# EasyEDA Pro project v3_uecu_hibrid.epro

# Schematic UECU
Board Name: UECU; Create Date: 2025-11-15; Page Name: UECU; Project Name: ECU_v3; Schematic Name: UECU; Update Date: 2025-12-18; File: UECU; Id: /; Sheet: /
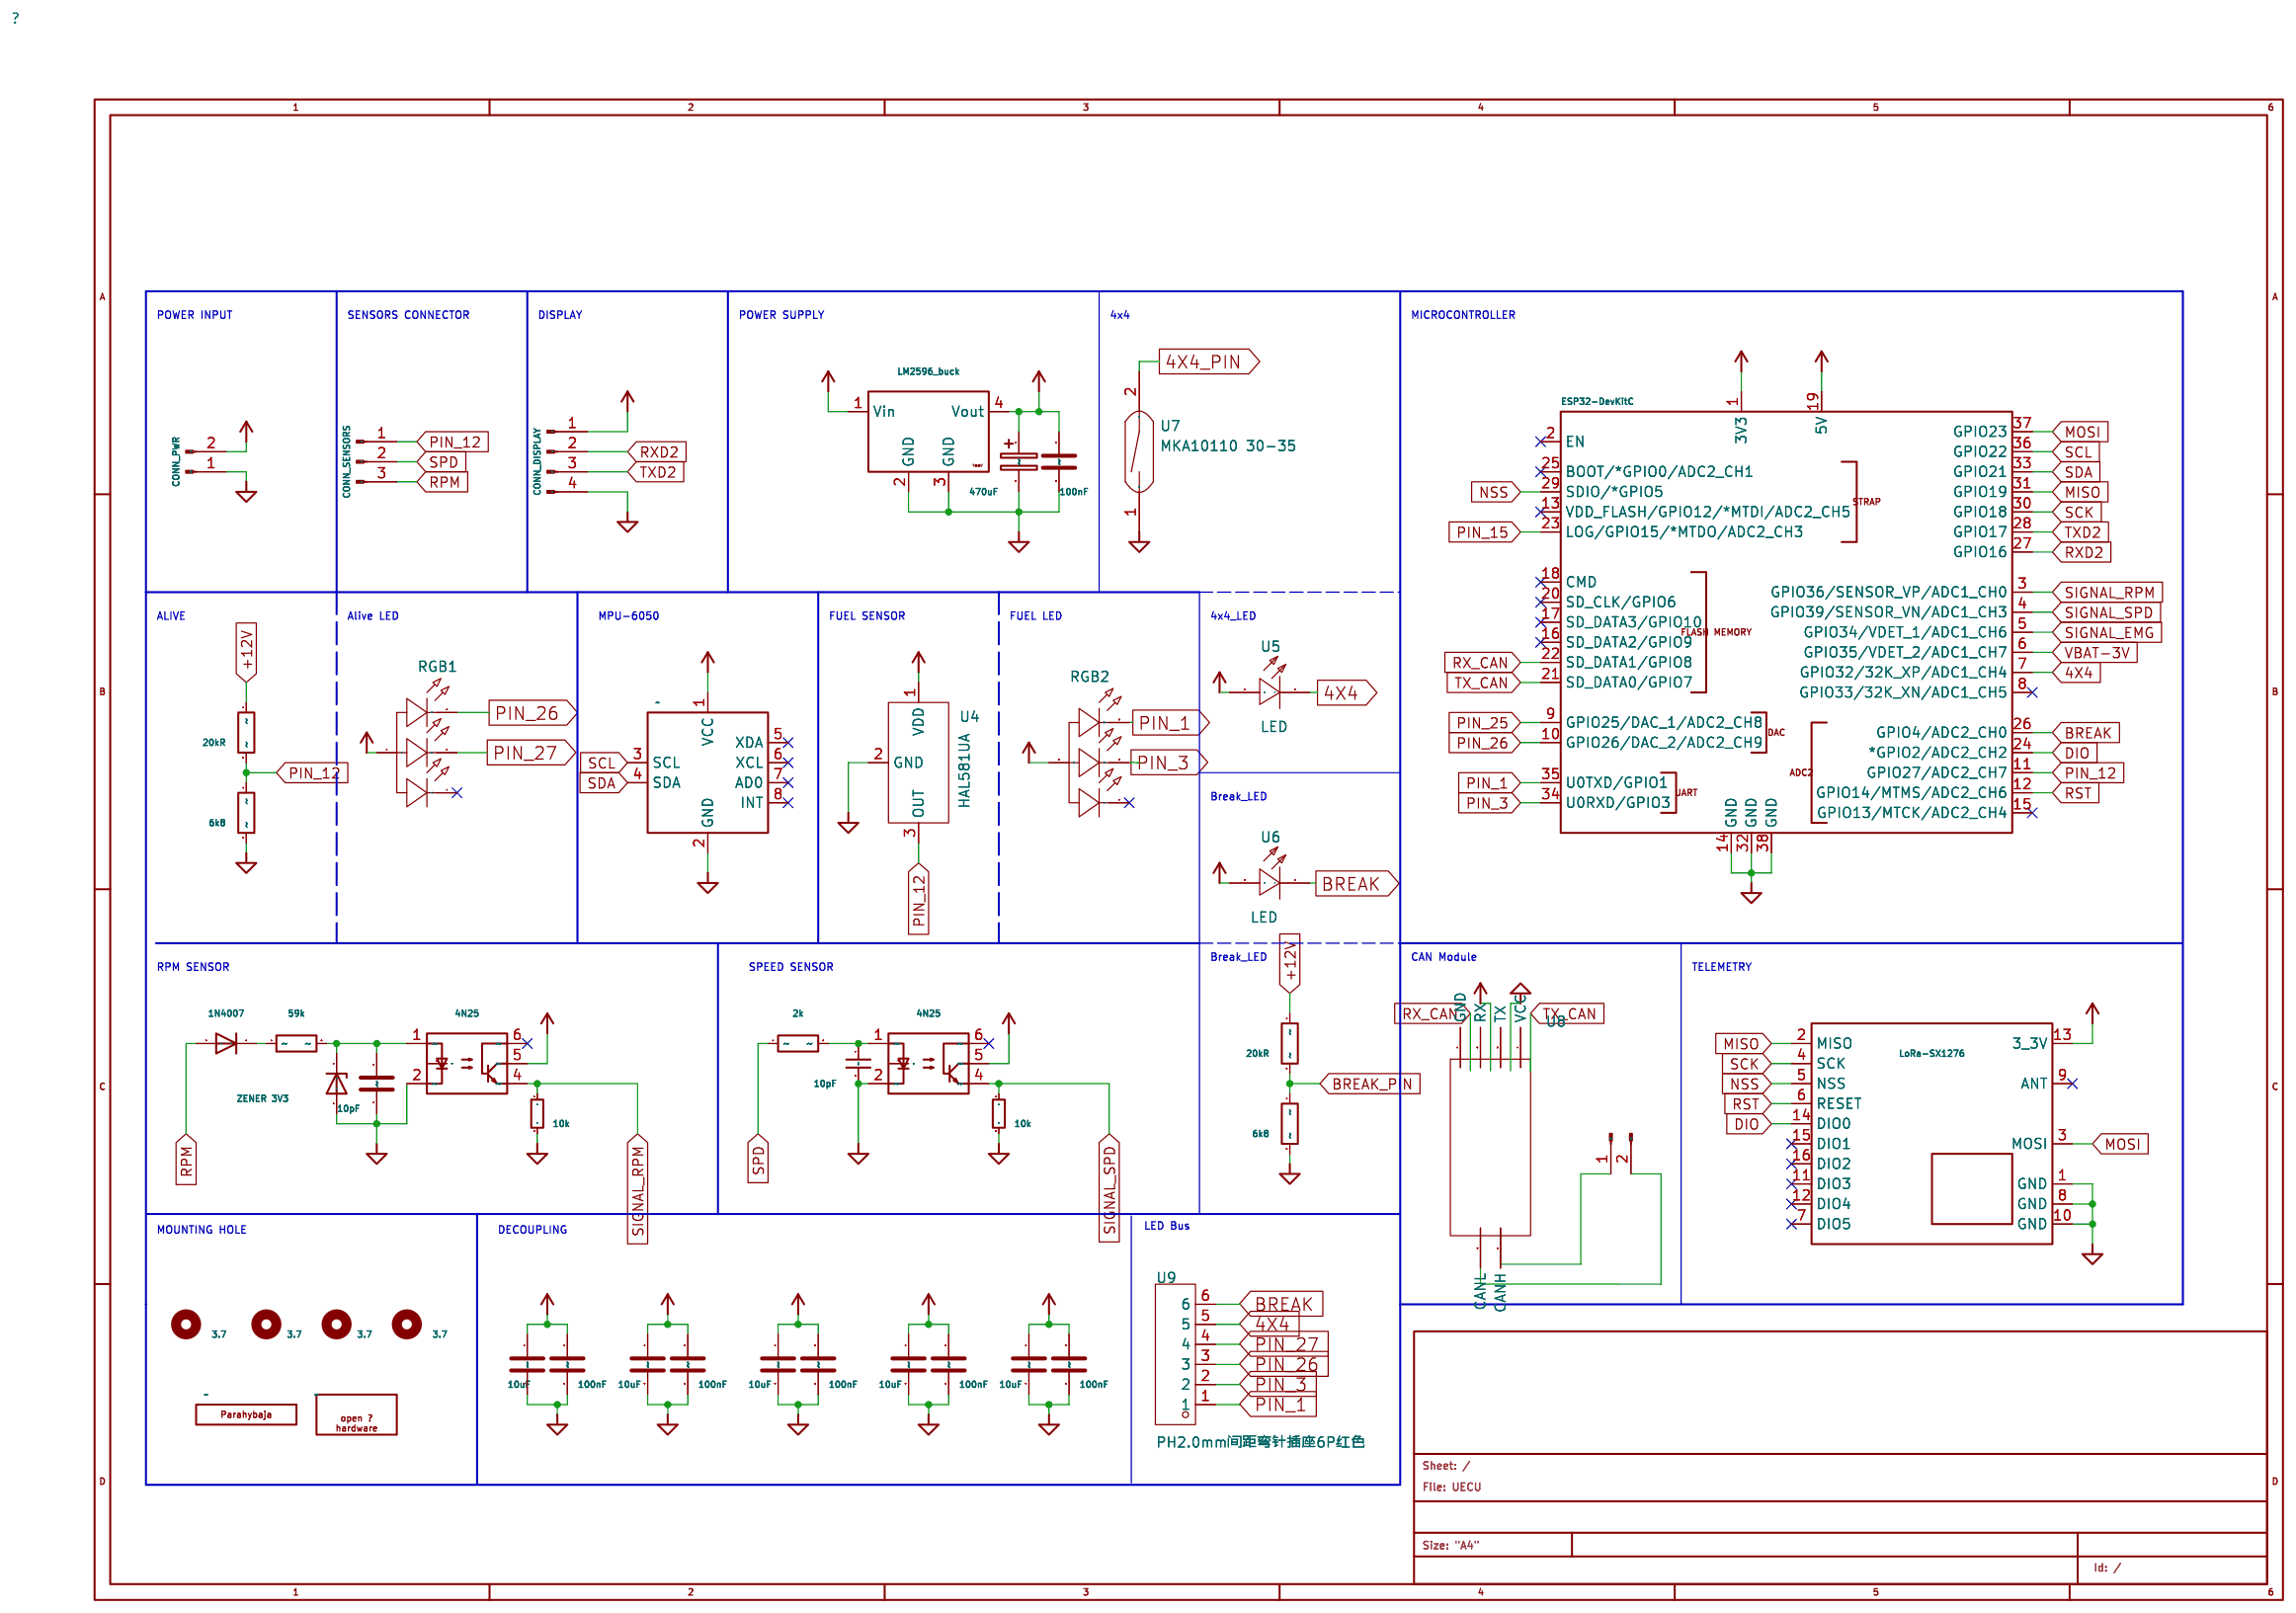
[diagram p0: schematic sheet]

## Parts
C1  470uF  [Capacitor_THT:CP_Radial_D6.3mm_P2.50mm]
C2  100nF  [Capacitor_THT:C_Disc_D5.0mm_W2.5mm_P5.00mm]
C4  100nF  [Capacitor_THT:C_Disc_D5.0mm_W2.5mm_P5.00mm]
C5  10uF  [Capacitor_THT:C_Disc_D5.0mm_W2.5mm_P5.00mm]
C6  100nF  [Capacitor_THT:C_Disc_D5.0mm_W2.5mm_P5.00mm]
C7  10uF  [Capacitor_THT:C_Disc_D5.0mm_W2.5mm_P5.00mm]
C8  10pF  [Capacitor_THT:C_Disc_D5.0mm_W2.5mm_P5.00mm]
C9  10uF  [Capacitor_THT:C_Disc_D5.0mm_W2.5mm_P5.00mm]
C10  100nF  [Capacitor_THT:C_Disc_D5.0mm_W2.5mm_P5.00mm]
C11  100nF  [Capacitor_THT:C_Disc_D5.0mm_W2.5mm_P5.00mm]
C12  10uF  [Capacitor_THT:C_Disc_D5.0mm_W2.5mm_P5.00mm]
C13  10uF  [Capacitor_THT:C_Disc_D5.0mm_W2.5mm_P5.00mm]
C14  10pF  [Capacitor_THT:C_Disc_D5.0mm_W2.5mm_P5.00mm]
C15  100nF  [Capacitor_THT:C_Disc_D5.0mm_W2.5mm_P5.00mm]
D2  1N4007  [Diode_THT:D_A-405_P7.62mm_Horizontal]
D3  ZENER 3V3  [Diode_THT:D_A-405_P7.62mm_Horizontal]
H1  3.7  [MountingHole:MountingHole_3.7mm]
H2  3.7  [MountingHole:MountingHole_3.7mm]
H3  3.7  [MountingHole:MountingHole_3.7mm]
H4  3.7  [MountingHole:MountingHole_3.7mm]
J1  CONN_PWR  [Connector_JST:JST_XH_B2B-XH-A_1x02_P2.50mm_Vertical]
J2  CONN_SENSORS  [Connector_JST:JST_XH_B3B-XH-A_1x03_P2.50mm_Vertical]
J3  CONN_DISPLAY  [Connector_JST:JST_XH_B4B-XH-A_1x04_P2.50mm_Vertical]
J5  CONN_CAN_BUS  [Connector_JST:JST_XH_B2B-XH-A_1x02_P2.50mm_Vertical]
L1  -  [Logos:parahybaja]
L2  -  [Logos:open_hardware]
MCU1  ESP32-DevKitC  [Espressif:ESP32-DevKitC]
P1  LM2596_buck  [StepDown:StepDown_LM2596]
R3  20kR  [Resistor_THT:R_Axial_DIN0207_L6.3mm_D2.5mm_P7.62mm_Horizontal]
R6  59k  [Resistor_THT:R_Axial_DIN0207_L6.3mm_D2.5mm_P7.62mm_Horizontal]
R7  2k  [Resistor_THT:R_Axial_DIN0207_L6.3mm_D2.5mm_P7.62mm_Horizontal]
R8  10k  [Resistor_THT:R_Axial_DIN0207_L6.3mm_D2.5mm_P7.62mm_Horizontal]
R9  10k  [Resistor_THT:R_Axial_DIN0207_L6.3mm_D2.5mm_P7.62mm_Horizontal]
R10  6k8  [Resistor_THT:R_Axial_DIN0207_L6.3mm_D2.5mm_P7.62mm_Horizontal]
R11  20kR  [Resistor_THT:R_Axial_DIN0207_L6.3mm_D2.5mm_P7.62mm_Horizontal]
R12  6k8  [Resistor_THT:R_Axial_DIN0207_L6.3mm_D2.5mm_P7.62mm_Horizontal]
RGB1  LED_RGB红蓝双色  [LED-SMD_4P-L3.2-W1.5_LED_RGB-A]
RGB2  LED_RGB红蓝双色  [LED-SMD_4P-L3.2-W1.5_LED_RGB-A]
S1  -  [Connector_PinHeader_2.54mm:PinHeader_1x08_P2.54mm_Vertical]
T1  LoRa-SX1276  [LoRa_SX1276:LoRa_SX1276]
U2  4N25  [Package_DIP:DIP-6_W7.62mm]
U3  4N25  [Package_DIP:DIP-6_W7.62mm]
U4  HAL581UA  [TO-92S-3_L4.1-W1.7-P1.27-L]
U5  LED  [LED-TH_BD4.0-P2.54-FD_RED]
U6  LED  [LED-TH_BD4.0-P2.54-FD_RED]
U7  MKA10110 30-35  [SW-TH_BD1.8-L10.0-P14.00-D0.5]
U8  -  [CAN Module TJA1050]
U9  PH2.0mm间距弯针插座6P红色  [CONN-TH_6P-P2.00_KINGHELM_KH-PH-6P-W]

## Library data of the parts
C1 = Device_C_Polarized
C2 C4-C7 C9-C13 C15 = Device_C: Attribute1: C8
C8 = Device_C
C14 = Device_C_Small
D2 = Device_D: Sim_Device: D; Sim_Pins: 1=K 2=A; Sim.Device: D; Sim.Pins: 1=K 2=A
D3 = Device_D_Zener: Attribute1: K; Attribute3: K
H1 = Mechanical_MountingHole
H2-H4 = Mechanical_MountingHole: Attribute1: H1
J1 = Connector_Conn_01x02_Pin
J2 = Connector_Conn_01x03_Pin: Attribute1: J3
J3 = Connector_Conn_01x04_Pin: Attribute1: J2
J5 = Connector_Conn_01x02_Pin: Attribute1: J1
L1 = Logos_parahybaja
L2 = Logos_open-hardware
MCU1 = Espressif_ESP32-DevKitC: Attribute1: VP/GPIO36; Attribute2: GPIO13/MTCK; Attribute3: GND; Attribute4: GPIO4; Attribute5: GPIO21; Attribute6: GPIO18; Attribute7: 5V; Attribute8: D0; Attribute9: GPIO5; Attribute10: GPIO26; Attribute11: D3; Attribute12: GPIO32; Attribute13: 3V3; Attribute14: VN/GPIO39; Attribute15: GND; Attribute16: GPIO15/MTDO; Attribute17: GND; Attribute18: GPIO27; Attribute19: GPIO22; Attribute20: GPIO25; Attribute21: GPIO23; Attribute22: GPIO33; Attribute23: D2; Attribute24: GPIO17; Attribute25: GPIO3/U0RXD; Attribute26: GPIO12/MTDI; Attribute27: GPIO19; Attribute28: GPIO16; Attribute29: GPIO1/U0TXD; Attribute30: GPIO0; Attribute31: GPIO34; Attribute32: GPIO35; Attribute33: CMD; Attribute34: GPIO2; Attribute35: GPIO14/MTMS; Attribute36: CLK; Attribute37: D1; Attribute38: EN/RESET; Attribute39: REF**; User doc link: https://docs.espressif.com/projects/esp-idf/zh_CN/latest/esp32/hw-reference/esp32/get-started-devkitc.html
P1 = StepDown_LM2596_YAAJ_DCDC_StepDown_LM2596: Attribute1: REF**
R3 R6 R7 R10-R12 = Device_R: Attribute1: R4
R8 R9 = Device_R_Small
RGB1 RGB2 = LED_RGB红蓝双色: Supplier Part: C9900002410; Supplier Footprint: RGB_LED; JLCPCB Part Class: Extended Part; Supplier: LCSC
S1 = MPU6050_MPU6050
T1 = LoRa-SX1276_LoRa-SX1276
U2 = Isolator_4N25: Attribute1: U3; User doc link: https://www.vishay.com/docs/83725/4n25.pdf
U3 = Isolator_4N25: User doc link: https://www.vishay.com/docs/83725/4n25.pdf
U4 = HAL581UA: Type:- Voltage - Supply:3.5V~24V Voltage - Supply:3.5V~24V Output Current:- Operation Points:70Gs Operation Points:70Gs Release Points:45Gs Release Points:45Gs Magnetic delay:25Gs Operating Temperature:-40℃~+150℃ Operating Temperature:-40℃~+150℃; LCSC Part Name: 单极性霍尔开关,马达霍尔管, 停产; Supplier Part: C7420968; Manufacturer: Hallwee(霍尔微电子); Supplier Footprint: TO-92S; JLCPCB Part Class: Extended Part; Datasheet: https://atta.szlcsc.com/upload/public/pdf/source/20230614/912E2566E2C353A023B1CDC2A630033A.pdf; Supplier: LCSC; Voltage - Supply: 3.5V~24V; Operation Points: 70Gs; Release Points: 45Gs; Magnetic delay: 25Gs; Operating Temperature: -40℃~+150℃
U5 U6 = LED: Supplier Part: C9900015665; Supplier Footprint: SIP-2P; JLCPCB Part Class: Extended Part; Supplier: LCSC
U7 = MKA10110 30-35: Supplier Part: C5154119; Manufacturer: MKA; Supplier Footprint: 插件; JLCPCB Part Class: Extended Part; Supplier: LCSC
U8 = CAN Module TJA1050
U9 = PH2.0mm间距弯针插座6P红色: Supplier Part: C9900029679; Supplier Footprint: 6PIN-2.0MM; JLCPCB Part Class: Extended Part; Supplier: LCSC

## Nets
+12V: C7.1 C11.1 J1.2(Pin) P1.1(Vin) R3.1 R11.1
VBAT-3V: MCU1.6(GPIO35/VDET_2/ADC1_CH7)
4X4: MCU1.7(GPIO32/32K_XP/ADC1_CH4) U5.2(-) U9.5
4X4_PIN: U7.2
BREAK: MCU1.26(GPIO4/ADC2_CH0) U6.2(-) U9.6
BREAK_PIN: R11.2 R12.1
DIO: MCU1.24(*GPIO2/ADC2_CH2) T1.14(DIO0)
MISO: MCU1.31(GPIO19) T1.2(MISO)
MOSI: MCU1.37(GPIO23) T1.3(MOSI)
NSS: MCU1.29(SDIO/*GPIO5) T1.5(NSS)
PIN_1: MCU1.35(U0TXD/GPIO1) RGB2.3 U9.1
PIN_3: MCU1.34(U0RXD/GPIO3) RGB2.2 U9.2
PIN_12: J2.1(Pin) MCU1.11(GPIO27/ADC2_CH7) R3.2 R10.1 U4.3(OUT)
PIN_15: MCU1.23(LOG/GPIO15/*MTDO/ADC2_CH3)
PIN_25: MCU1.9(GPIO25/DAC_1/ADC2_CH8)
PIN_26: MCU1.10(GPIO26/DAC_2/ADC2_CH9) RGB1.3 U9.3
PIN_27: RGB1.2 U9.4
POWER_+3V3: C5.1 C6.1 C9.1 C10.1 MCU1.1(3V3) RGB1.1 RGB2.1 T1.13(3_3V) U2.5 U3.5 U4.1(VDD) U5.1(+) U6.1(+)
POWER_+5V: C1.1 C2.1 C4.1 C12.1 C13.1 C15.1 J3.1(Pin) MCU1.19(5V) P1.4(Vout) S1.1(VCC)
POWER_GND: C1.2 C2.2 C4.2 C5.2 C6.2 C7.2 C8.2 C9.2 C10.2 C11.2 C12.2 C13.2 C14.2 C15.2 D3.2(A) J1.1(Pin) J3.4(Pin) MCU1.14(GND) MCU1.32(GND) MCU1.38(GND) P1.2(GND) P1.3(GND) R8.2 R9.2 R10.2 R12.2 S1.2(GND) T1.1(GND) T1.8(GND) T1.10(GND) U2.2 U3.2 U4.2(GND) U7.1
RPM: D2.2(A) J2.3(Pin)
RST: MCU1.12(GPIO14/MTMS/ADC2_CH6) T1.6(RESET)
RX_CAN: MCU1.22(SD_DATA1/GPIO8)
RXD2: J3.2(Pin) MCU1.27(GPIO16)
SCK: MCU1.30(GPIO18) T1.4(SCK)
SCL: MCU1.36(GPIO22) S1.3(SCL)
SDA: MCU1.33(GPIO21) S1.4(SDA)
SIGNAL_EMG: MCU1.5(GPIO34/VDET_1/ADC1_CH6)
SIGNAL_RPM: MCU1.3(GPIO36/SENSOR_VP/ADC1_CH0) R8.1 U2.4
SIGNAL_SPD: MCU1.4(GPIO39/SENSOR_VN/ADC1_CH3) R9.1 U3.4
SPD: J2.2(Pin) R7.1
TX_CAN: MCU1.21(SD_DATA0/GPIO7)
TXD2: J3.3(Pin) MCU1.28(GPIO17)
$1N3: C8.1 D3.1(K) R6.2 U2.1
$1N7: D2.1(K) R6.1
$1N75: C14.1 R7.2 U3.1
$1N8433: J5.1(Pin) U8.6(CANH)
$1N8440: J5.2(Pin) U8.5(CANL)

Not connected (* = marked no-connect by the designer): MCU1 2(EN)* 8(GPIO33/32K_XN/ADC1_CH5)* 13(VDD_FLASH/GPIO12/*MTDI/ADC2_CH5)* 15(GPIO13/MTCK/ADC2_CH4)* 16(SD_DATA2/GPIO9)* 17(SD_DATA3/GPIO10)* 18(CMD)* 20(SD_CLK/GPIO6)* 25(BOOT/*GPIO0/ADC2_CH1)*; RGB1 4*; RGB2 4*; S1 5(XDA)* 6(XCL)* 7(AD0)* 8(INT)*; T1 7(DIO5)* 9(ANT)* 11(DIO3)* 12(DIO4)* 15(DIO1)* 16(DIO2)*; U2 3(NC) 6*; U3 3(NC) 6*; U8 1(GND) 2(RX) 3(TX) 4(VCC)

## Notes on the sheet
- POWER INPUT
- SENSORS CONNECTOR
- DISPLAY
- POWER SUPPLY
- 4x4
- MICROCONTROLLER
- ALIVE
- Alive LED
- MPU-6050
- FUEL SENSOR
- FUEL LED
- 4x4_LED
- Break_LED
- Break_LED
- CAN Module
- RPM SENSOR
- SPEED SENSOR
- TELEMETRY
- MOUNTING HOLE
- DECOUPLING
- LED Bus

# Board UECU
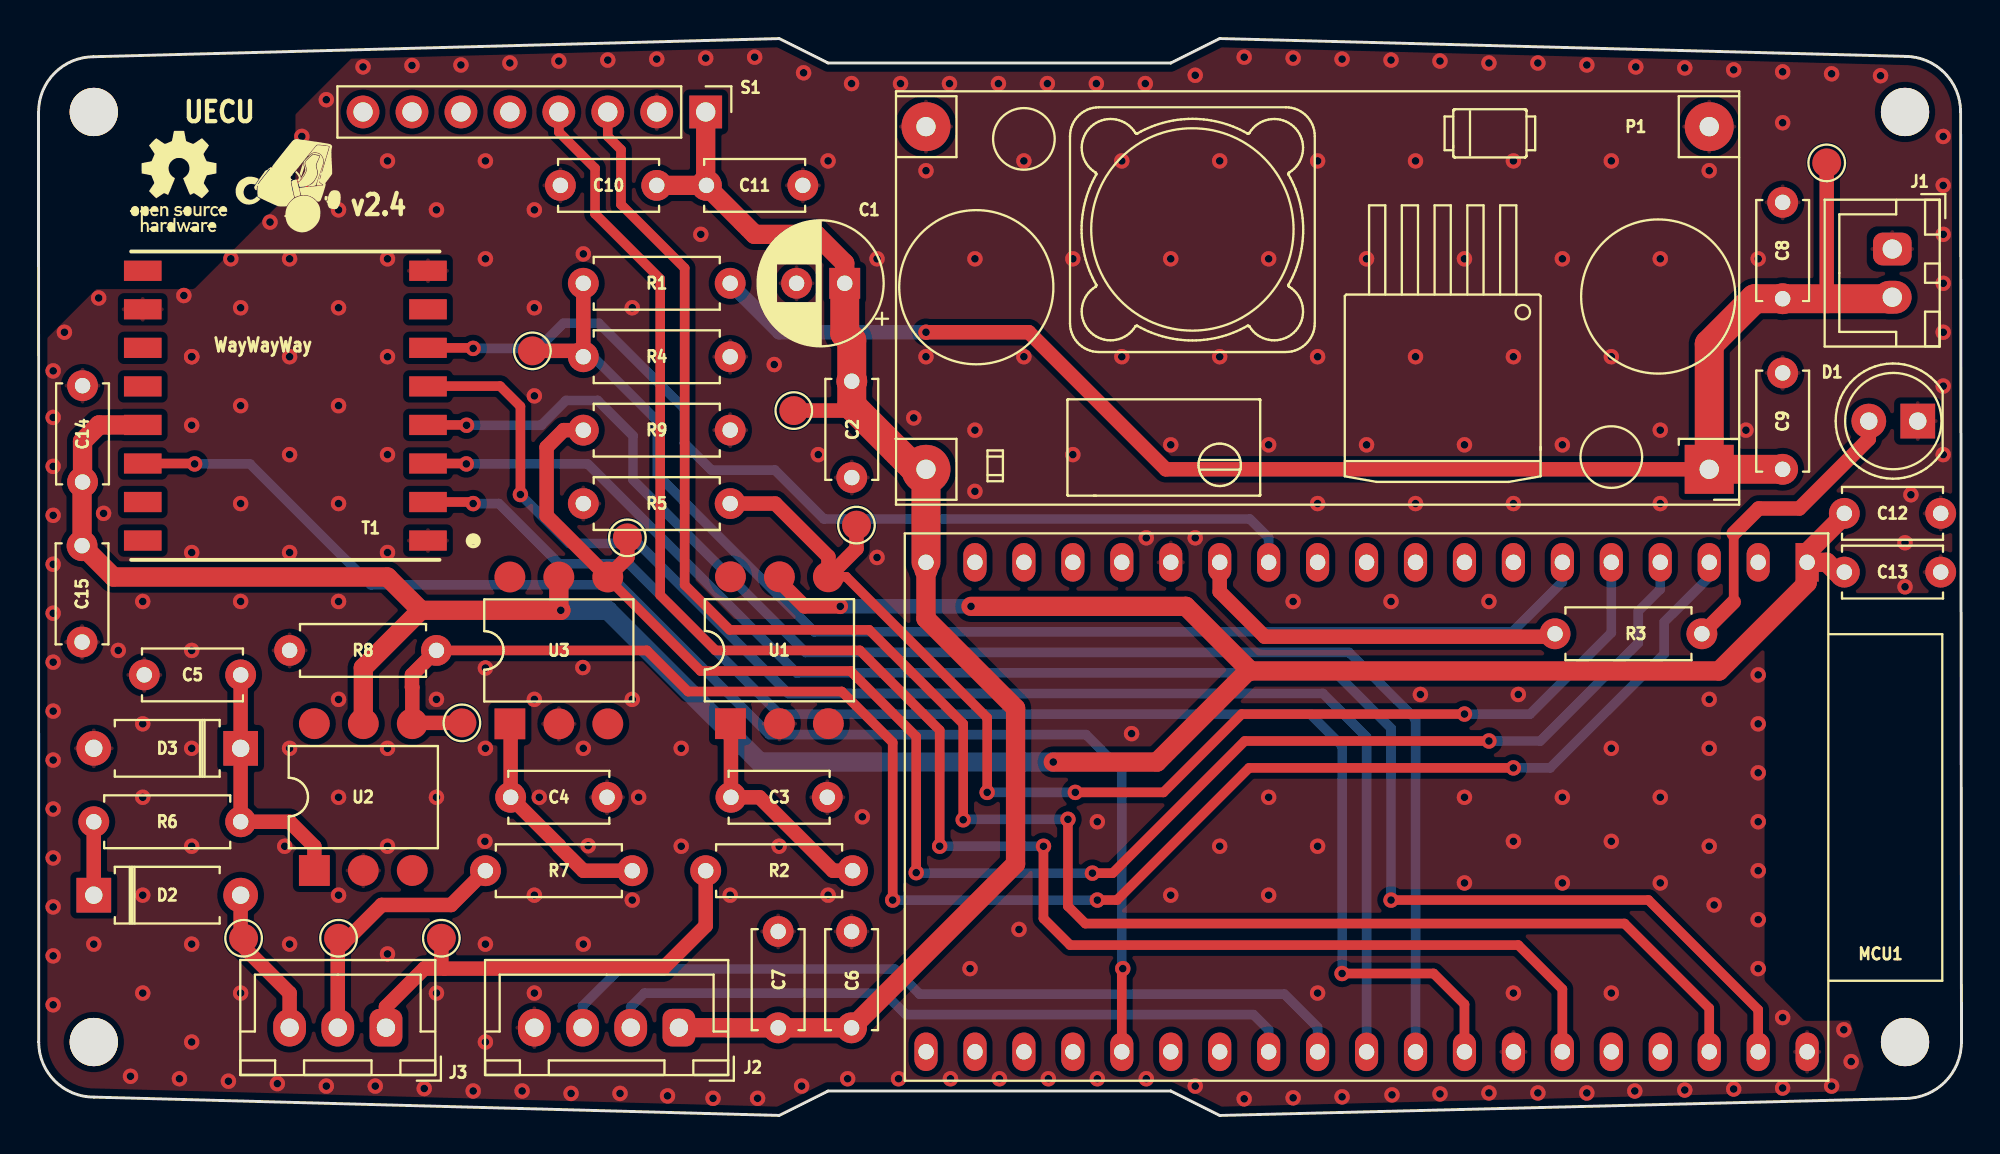
[diagram p1: board, top side]
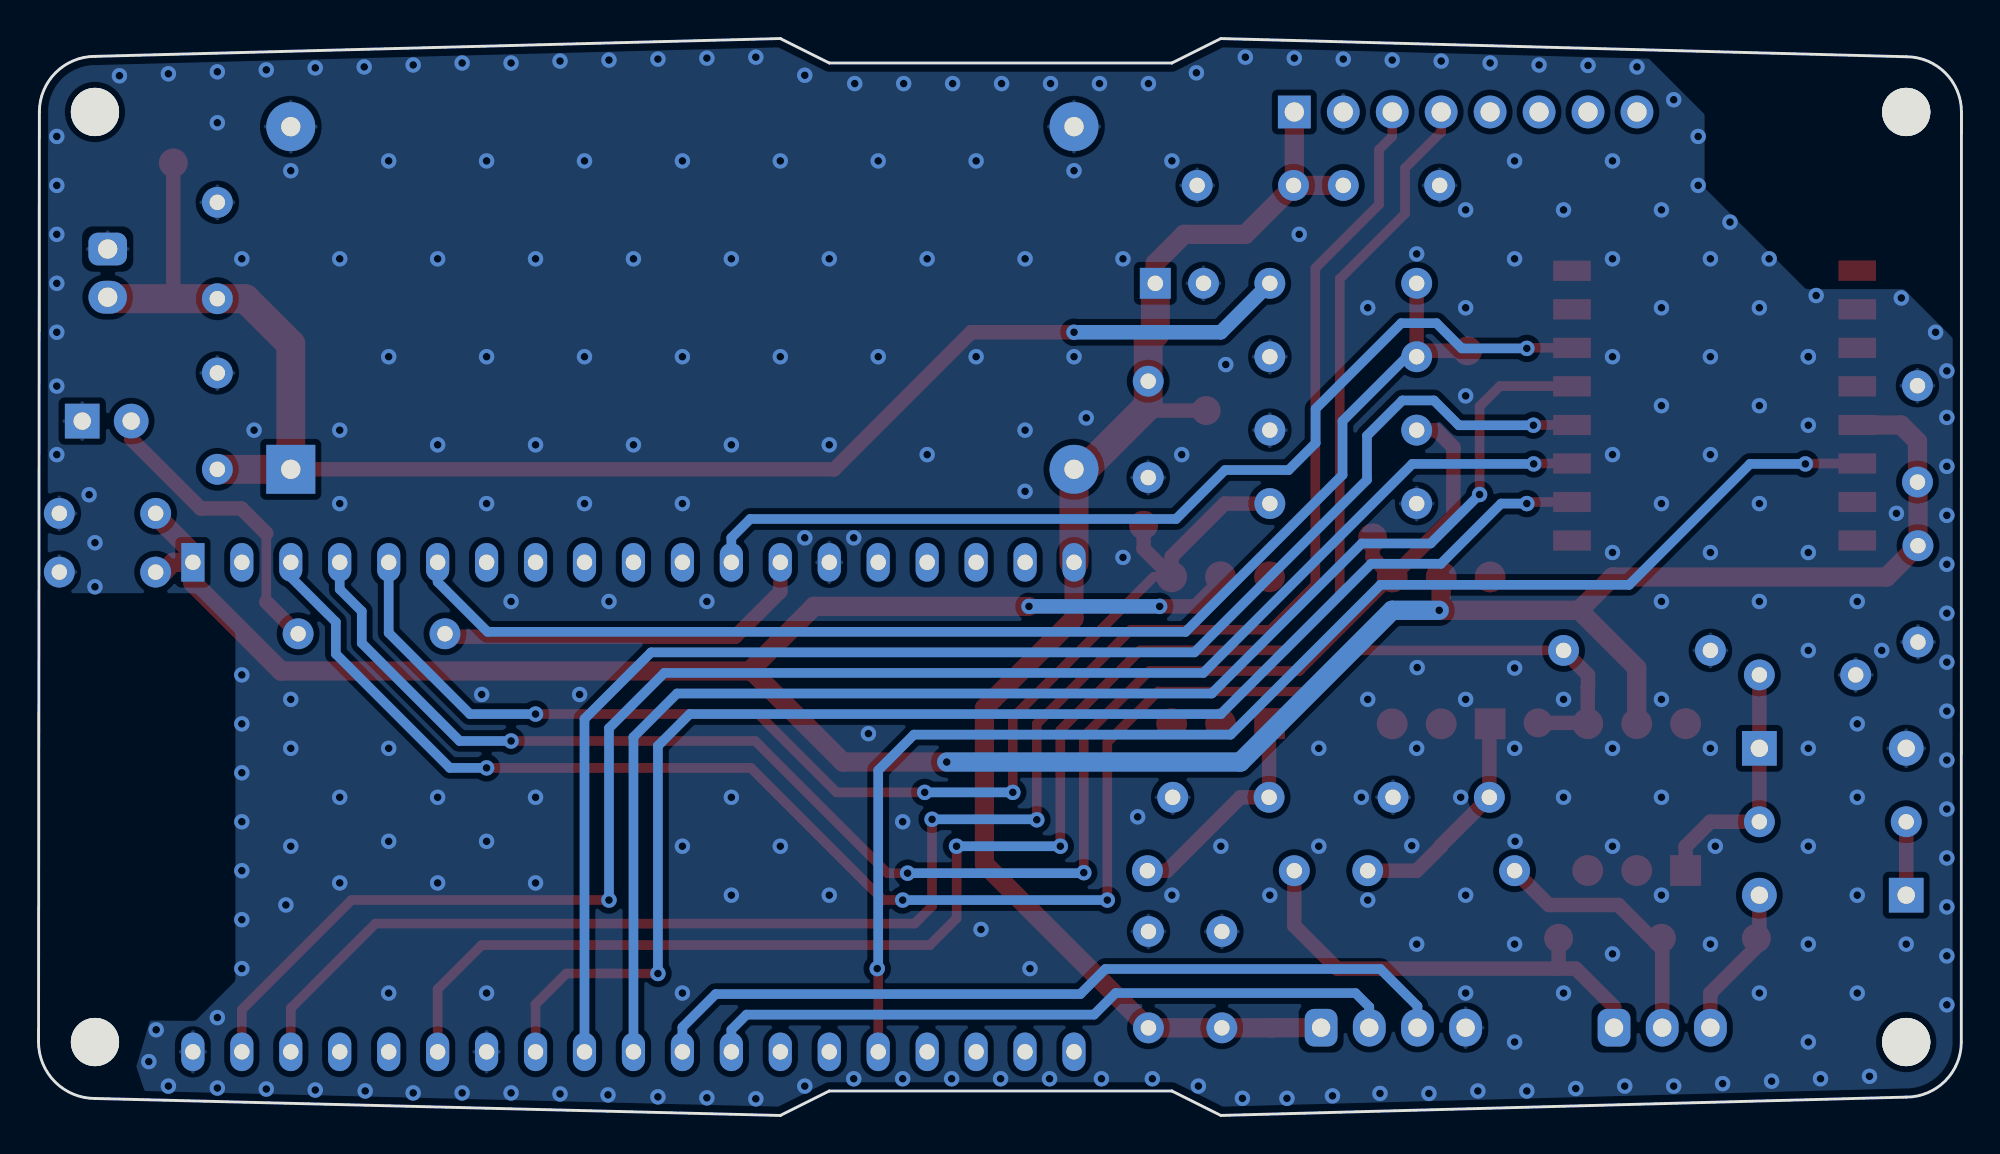
[diagram p2: board, bottom side, seen from below]

Outline 99.77 x 55.88 mm; copper layers: Top Layer, Bottom Layer. Coordinates in mm from the lower left corner of the outline.
Outline path: 0,52.07 0.01,3.81 arc(0.85,1.79) 2.87,0.95 38.43,0 40.97,1.27 58.75,1.27 61.29,0 96.85,0.88 arc(98.92,1.74) 99.77,3.81 99.73,52.07 arc(98.89,54.11) 96.85,54.95 61.29,55.88 58.75,54.61 40.97,54.61 38.43,55.88 2.87,54.94 arc(0.84,54.1) 0,52.07
Stack: Top Layer 0.0009mm / dielectric 1 0.0384mm FR4 er 4.5 / Bottom Layer 0.0009mm

## Design rules (mm)
spacing safeClearance (default): track to track 0.152, other pairs 0.152 to 0.3
track width trackWidth (default): min 0.127, default 0.254, max 2.54
differential pair differentialPair (default): width min 0.127, default 0.254, max 2.54; gap min 0.152, default 0.152
via viaSize (default): diameter min 0.5, default 0.61, max 10; hole min 0.3, default 0.305, max 6
net GND uses CopperRegion1
pour ie1129 uses CopperRegion
pour ie1130 uses CopperRegion1

## Placement (name value [footprint] x y rotation side)
C1  470uF  [Capacitor_THT:CP_Radial_D6.3mm_P2.50mm]  41.83 43.18 180 top
C2  100nF  [Capacitor_THT:C_Disc_D5.0mm_W2.5mm_P5.00mm]  42.2 38.1 270 top
C3  10pF  [Capacitor_THT:C_Disc_D5.0mm_W2.5mm_P5.00mm]  35.93 16.51 0 top
C4  10pF  [Capacitor_THT:C_Disc_D5.0mm_W2.5mm_P5.00mm]  24.5 16.51 0 top
C5  10pF  [Capacitor_THT:C_Disc_D5.0mm_W2.5mm_P5.00mm]  10.49 22.86 180 top
C6  10uF  [Capacitor_THT:C_Disc_D5.0mm_W2.5mm_P5.00mm]  42.19 4.55 90 top
C7  100nF  [Capacitor_THT:C_Disc_D5.0mm_W2.5mm_P5.00mm]  38.38 4.55 90 top
C8  -  [Capacitor_THT:C_Disc_D5.0mm_W2.5mm_P5.00mm]  90.5 42.38 90 top
C9  100nF  [Capacitor_THT:C_Disc_D5.0mm_W2.5mm_P5.00mm]  90.5 33.53 90 top
C10  10uF  [Capacitor_THT:C_Disc_D5.0mm_W2.5mm_P5.00mm]  32.08 48.26 180 top
C11  100nF  [Capacitor_THT:C_Disc_D5.0mm_W2.5mm_P5.00mm]  34.66 48.26 0 top
C12  10uF  [Capacitor_THT:C_Disc_D5.0mm_W2.5mm_P5.00mm]  93.7 31.24 0 top
C13  100nF  [Capacitor_THT:C_Disc_D5.0mm_W2.5mm_P5.00mm]  93.7 28.19 0 top
C14  10uF  [Capacitor_THT:C_Disc_D5.0mm_W2.5mm_P5.00mm]  2.28 32.87 90 top
C15  100nF  [Capacitor_THT:C_Disc_D5.0mm_W2.5mm_P5.00mm]  2.26 29.57 270 top
D1  LED  [LED_THT:LED_D5.0mm]  97.51 36.03 180 top
D2  1N4007  [Diode_THT:D_A-405_P7.62mm_Horizontal]  2.87 11.43 0 top
D3  ZENER 3V3  [Diode_THT:D_A-405_P7.62mm_Horizontal]  10.49 19.05 180 top
H1  3.7  [MountingHole:MountingHole_3.7mm]  2.87 52.07 0 top
H2  3.7  [MountingHole:MountingHole_3.7mm]  96.85 52.07 0 top
H3  3.7  [MountingHole:MountingHole_3.7mm]  2.87 3.81 0 top
H4  3.7  [MountingHole:MountingHole_3.7mm]  96.85 3.81 0 top
J1  Conn_pwr  [Connector_JST:JST_XH_B2B-XH-A_1x02_P2.50mm_Vertical]  96.19 44.96 270 top
J2  Conn_display  [Connector_JST:JST_XH_B4B-XH-A_1x04_P2.50mm_Vertical]  33.23 4.55 180 top
J3  Conn_SENSORS  [Connector_JST:JST_XH_B3B-XH-A_1x03_P2.50mm_Vertical]  18.03 4.55 180 top
L1  ~  [Logos:parahybaja]  13.03 48.26 0 top
L2  ~  [Logos:open_hardware]  7.29 48.46 0 top
MCU1  ESP32-DevKitC  [Espressif:ESP32-DevKitC]  91.77 28.7 270 top
P1  LM2596_buck  [StepDown:StepDown_LM2596]  86.69 33.53 180 top
R1  10k  [Resistor_THT:R_Axial_DIN0207_L6.3mm_D2.5mm_P7.62mm_Horizontal]  35.89 43.18 180 top
R2  2k  [Resistor_THT:R_Axial_DIN0207_L6.3mm_D2.5mm_P7.62mm_Horizontal]  34.62 12.7 0 top
R3  470R  [Resistor_THT:R_Axial_DIN0207_L6.3mm_D2.5mm_P7.62mm_Horizontal]  78.69 24.99 0 top
R4  -  [Resistor_THT:R_Axial_DIN0207_L6.3mm_D2.5mm_P7.62mm_Horizontal]  28.27 39.37 0 top
R5  10k  [Resistor_THT:R_Axial_DIN0207_L6.3mm_D2.5mm_P7.62mm_Horizontal]  35.89 31.75 180 top
R6  59k  [Resistor_THT:R_Axial_DIN0207_L6.3mm_D2.5mm_P7.62mm_Horizontal]  2.87 15.24 0 top
R7  2k  [Resistor_THT:R_Axial_DIN0207_L6.3mm_D2.5mm_P7.62mm_Horizontal]  23.19 12.7 0 top
R8  10k  [Resistor_THT:R_Axial_DIN0207_L6.3mm_D2.5mm_P7.62mm_Horizontal]  20.65 24.13 180 top
R9  10k  [Resistor_THT:R_Axial_DIN0207_L6.3mm_D2.5mm_P7.62mm_Horizontal]  28.27 35.56 0 top
REF**  -  [TestPoint:TestPoint_Pad_D1.5mm]  42.44 30.63 0 top
REF**#2  -  [TestPoint:TestPoint_Pad_D1.5mm]  21.97 20.37 0 top
REF**#3  -  [TestPoint:TestPoint_Pad_D1.5mm]  92.78 49.43 0 top
REF**#4  -  [TestPoint:TestPoint_Pad_D1.5mm]  25.62 39.67 0 top
REF**#5  -  [TestPoint:TestPoint_Pad_D1.5mm]  20.9 9.19 0 top
REF**#6  -  [TestPoint:TestPoint_Pad_D1.5mm]  30.55 29.97 0 top
REF**#7  -  [TestPoint:TestPoint_Pad_D1.5mm]  39.19 36.58 0 top
REF**#8  -  [TestPoint:TestPoint_Pad_D1.5mm]  10.64 9.19 0 top
REFe  TestPoint_Pad_D1.5mm  [TestPoint:TestPoint_Pad_D1.5mm]  15.57 9.19 0 top
S1  ~  [Connector_PinHeader_2.54mm:PinHeader_1x08_P2.54mm_Vertical]  34.62 52.07 270 top
T1  LoRa-SX1276  [LoRa_SX1276:LoRa_SX1276]  12.81 36.83 180 top
U1  4N25  [Package_DIP:DIP-6_W7.62mm]  35.9 20.33 90 top
U2  4N25  [Package_DIP:DIP-6_W7.62mm]  14.31 12.71 90 top
U3  4N25  [Package_DIP:DIP-6_W7.62mm]  24.46 20.32 90 top

## Footprints (pads in the part's own frame, mm; a bottom-side part is the same pattern mirrored in y, then rotated)
Capacitor_THT:C_Disc_D5.0mm_W2.5mm_P5.00mm
  round 1.6 hole 0.8: 1(0,0) 2(5,0)
Capacitor_THT:CP_Radial_D6.3mm_P2.50mm
  rect 1.6x1.6 hole 0.8: 1(0,0)
  round 1.6 hole 0.8: 2(2.5,0)
Connector_JST:JST_XH_B2B-XH-A_1x02_P2.50mm_Vertical
  rrect 1.7x2 hole 1: 1(0,0)
  oval 1.7x2 hole 1: 2(2.5,0)
Connector_JST:JST_XH_B3B-XH-A_1x03_P2.50mm_Vertical
  rrect 1.7x1.95 hole 0.95: 1(0,0)
  oval 1.7x1.95 hole 0.95: 2(2.5,0) 3(5,0)
Connector_JST:JST_XH_B4B-XH-A_1x04_P2.50mm_Vertical
  rrect 1.7x1.95 hole 0.95: 1(0,0)
  oval 1.7x1.95 hole 0.95: 2(2.5,0) 3(5,0) 4(7.5,0)
Connector_PinHeader_2.54mm:PinHeader_1x08_P2.54mm_Vertical
  rect 1.7x1.7 hole 1: 1(0,0)
  round 1.7 hole 1: 2(0,-2.54) 3(0,-5.08) 4(0,-7.62) 5(0,-10.16) 6(0,-12.7) 7(0,-15.24) 8(0,-17.78)
Diode_THT:D_A-405_P7.62mm_Horizontal
  rect 1.8x1.8 hole 0.9: 1(0,0)
  round 1.8 hole 0.9: 2(7.62,0)
Espressif:ESP32-DevKitC
  rect 2x1.2 hole 0.8: 1(0,0)
  oval 2x1.2 hole 0.8: 2(0,-2.54) 3(0,-5.08) 4(0,-7.62) 5(0,-10.16) 6(0,-12.7) 7(0,-15.24) 8(0,-17.78) 9(0,-20.32) 10(0,-22.86) 11(0,-25.4) 12(0,-27.94) 13(0,-30.48) 14(0,-33.02) 15(0,-35.56) 16(0,-38.1) 17(0,-40.64) 18(0,-43.18) 19(0,-45.72) 20(25.396,-45.718) 21(25.396,-43.178) 22(25.4,-40.64) 23(25.4,-38.1) 24(25.4,-35.56) 25(25.4,-33.02) 26(25.4,-30.48) 27(25.4,-27.94) 28(25.4,-25.4) 29(25.4,-22.86) 30(25.4,-20.32) 31(25.4,-17.78) 32(25.4,-15.24) 33(25.4,-12.7) 34(25.4,-10.16) 35(25.4,-7.62) 36(25.4,-5.08) 37(25.4,-2.54) 38(25.4,0)
LED_THT:LED_D5.0mm
  rect 1.8x1.8 hole 0.9: 1(0,0)
  round 1.8 hole 0.9: 2(2.54,0)
LoRa_SX1276:LoRa_SX1276
  rect 1.95x1.05 smd: 1(-7.4,7) 2(-7.4,5) 3(-7.4,3) 4(-7.4,1) 5(-7.4,-1) 6(-7.4,-3) 7(-7.4,-5) 8(-7.4,-7) 9(7.4,-7) 10(7.4,-5) 11(7.4,-3) 12(7.4,-1) 13(7.4,1) 14(7.4,3) 15(7.4,5) 16(7.4,7)
MountingHole:MountingHole_3.7mm
  round 2.5 hole 2.5: (0,0)
Package_DIP:DIP-6_W7.62mm
  rect 1.6x1.6 smd: 1(0,0)
  round 1.6 smd: 2(0,-2.54) 3(0,-5.08) 4(7.62,-5.08) 5(7.62,-2.54) 6(7.62,0)
Resistor_THT:R_Axial_DIN0207_L6.3mm_D2.5mm_P7.62mm_Horizontal
  round 1.6 hole 0.8: 1(0,0) 2(7.62,0)
StepDown:StepDown_LM2596
  rect 2.54x2.54 hole 1: 1(0,0)
  round 2.54 hole 1: 2(0,-17.78) 3(40.64,-17.78) 4(40.64,0)
TestPoint:TestPoint_Pad_D1.5mm
  round 1.5 smd: 1(0,0)

## Nets
+3V3: C12.1 C13.1 C14.1 C15.1 MCU1.1 T1.13 U1.5 U2.5 U3.5
+5V: C1.1 C2.1 C6.1 C7.1 C10.1 C11.1 J2.1 MCU1.19 P1.4 REF**#7.1 S1.1
+12V: C8.1 C9.1 J1.2 P1.1 R1.1 REF**#3.1
GND: C1.2 C2.2 C3.2 C4.2 C5.2 C6.2 C7.2 C8.2 C9.2 C10.2 C11.2 C12.2 C13.2 C14.2 C15.2 D1.1 D3.2 J1.1 J2.4 MCU1.14 MCU1.32 MCU1.38 P1.2 P1.3 R4.2 R5.2 R8.2 R9.2 S1.2 T1.1 T1.8 T1.10 U1.2 U2.2 U3.2
VBAT-3V: MCU1.6 R1.2 R4.1 REF**#4.1
CONN_EMG: J3.1 R2.1 REF**#5.1
CONN_RPM: D2.2 J3.3 REF**#8.1
CONN_SPD: J3.2 R7.1 REFe.1
DIO: MCU1.24 T1.14
LED_ALIVE: MCU1.13 R3.1
MISO: MCU1.31 T1.2
MOSI: MCU1.37 T1.3
NET-(C3-PAD1): C3.1 R2.2 U1.1
NET-(C4-PAD1): C4.1 R7.2 U3.1
NET-(D1-A): D1.2 R3.2
NET-(D2-K): D2.1 R6.1
NET-(D3-K): C5.1 D3.1 R6.2 U2.1
NSS: MCU1.29 T1.5
RST: MCU1.12 T1.6
RXD2: J2.2 MCU1.27
SCK: MCU1.30 T1.4
SCL: MCU1.36 S1.3
SDA: MCU1.33 S1.4
SIGNAL_EMG: MCU1.5 R5.1 REF**.1 U1.4
SIGNAL_RPM: MCU1.3 R8.1 REF**#2.1 U2.4
SIGNAL_SPD: MCU1.4 R9.1 REF**#6.1 U3.4
TXD2: J2.3 MCU1.28
UNCONNECTED-(MCU1-BOOT{SLASH}*GPIO0{SLASH}ADC2_CH1-PAD25): MCU1.25
UNCONNECTED-(MCU1-CMD-PAD18): MCU1.18
UNCONNECTED-(MCU1-EN-PAD2): MCU1.2
UNCONNECTED-(MCU1-GPIO4{SLASH}ADC2_CH0-PAD26): MCU1.26
UNCONNECTED-(MCU1-GPIO13{SLASH}MTCK{SLASH}ADC2_CH4-PAD15): MCU1.15
UNCONNECTED-(MCU1-GPIO25{SLASH}DAC_1{SLASH}ADC2_CH8-PAD9): MCU1.9
UNCONNECTED-(MCU1-GPIO26{SLASH}DAC_2{SLASH}ADC2_CH9-PAD10): MCU1.10
UNCONNECTED-(MCU1-GPIO27{SLASH}ADC2_CH7-PAD11): MCU1.11
UNCONNECTED-(MCU1-GPIO32{SLASH}32K_XP{SLASH}ADC1_CH4-PAD7): MCU1.7
UNCONNECTED-(MCU1-GPIO33{SLASH}32K_XN{SLASH}ADC1_CH5-PAD8): MCU1.8
UNCONNECTED-(MCU1-LOG{SLASH}GPIO15{SLASH}*MTDO{SLASH}ADC2_CH3-PAD23): MCU1.23
UNCONNECTED-(MCU1-SD_CLK{SLASH}GPIO6-PAD20): MCU1.20
UNCONNECTED-(MCU1-SD_DATA0{SLASH}GPIO7-PAD21): MCU1.21
UNCONNECTED-(MCU1-SD_DATA1{SLASH}GPIO8-PAD22): MCU1.22
UNCONNECTED-(MCU1-SD_DATA2{SLASH}GPIO9-PAD16): MCU1.16
UNCONNECTED-(MCU1-SD_DATA3{SLASH}GPIO10-PAD17): MCU1.17
UNCONNECTED-(MCU1-U0RXD{SLASH}GPIO3-PAD34): MCU1.34
UNCONNECTED-(MCU1-U0TXD{SLASH}GPIO1-PAD35): MCU1.35
UNCONNECTED-(S1-AD0-PAD7): S1.7
UNCONNECTED-(S1-INT-PAD8): S1.8
UNCONNECTED-(S1-XCL-PAD6): S1.6
UNCONNECTED-(S1-XDA-PAD5): S1.5
UNCONNECTED-(T1-ANT-PAD9): T1.9
UNCONNECTED-(T1-DIO1-PAD15): T1.15
UNCONNECTED-(T1-DIO2-PAD16): T1.16
UNCONNECTED-(T1-DIO3-PAD11): T1.11
UNCONNECTED-(T1-DIO4-PAD12): T1.12
UNCONNECTED-(T1-DIO5-PAD7): T1.7
UNCONNECTED-(U1-NC-PAD3): U1.3
UNCONNECTED-(U1-PAD6): U1.6
UNCONNECTED-(U2-NC-PAD3): U2.3
UNCONNECTED-(U2-PAD6): U2.6
UNCONNECTED-(U3-NC-PAD3): U3.3
UNCONNECTED-(U3-PAD6): U3.6

## Via types
v1: diameter 0.8, hole 0.4, Top Layer to Bottom Layer, 295 vias

## Routing (per net, layer and track width the routed paths; a pad name or vN(x,y) marks a point on that pad's centre or on a via; arc(x,y) is an arc through that point)
+3V3: length 148.9
  Top Layer w0.75: U1.5 38.44,27.72 39.75,26.42 v1(41.6,26.42)
  Top Layer w1: MCU1.1 91.77,29.21 93.7,31.14 C12.1 ; MCU1.1 91.77,27.63 87.19,23.06 62.89,23.06 ; MCU1.1 92.78,28.7 93.29,28.19 C13.1 ; 19.83,26.21 16.85,23.23 U2.5 ; 19.83,26.21 18.11,27.94 3.88,27.94 C15.1 2.26,32.84 C14.1 2.28,34.98 3.14,35.83 T1.13 ; 19.83,26.21 v1(27.1,26.21) 27,26.31 U3.5 ; 62.89,23.06 59.53,26.42 v1(48.38,26.42) ; 62.89,23.06 62.76,23.06 58.04,18.34 v1(52.65,18.34)
  Bottom Layer w0.75: v1(48.38,26.42) v1(41.6,26.42)
  Bottom Layer w1: v1(52.65,18.34) 37.41,18.34 29.54,26.21 v1(27.1,26.21)
+5V: length 74.6
  Top Layer w0.75: REF**#7.1 41.94,36.58 42.2,36.83
  Top Layer w1: J2.1 35.78,4.55 35.78,4.55 C7.1 C6.1 50.69,13.06 50.69,21.13 46.05,25.78 MCU1.19 ; S1.1 34.62,48.3 C11.1 ; C11.1 C10.1 ; C11.1 34.66,48.22 37.16,45.72 40.33,45.72 41.83,44.22 C1.1
  Top Layer w1.5: MCU1.19 P1.4 45.5,33.53 42.2,36.83 C2.1 ; C1.1 41.83,40.59 42.2,40.22 C2.1 ; 42.24,38.14 C2.1
+12V: length 82.7
  Top Layer w0.75: P1.1 58.49,33.53 51.38,40.64 v1(46.05,40.64) ; 92.83,42.38 92.78,42.43 REF**#3.1
  Top Layer w1.5: 96.21,42.38 C8.1 89.04,42.38 86.69,40.02 P1.1 C9.1
  Bottom Layer w0.75: R1.1 38.43,40.64 v1(46.05,40.64)
GND:
  vias: v1(0.76,38.63) v1(0.76,36.22) v1(0.76,33.68) v1(0.76,31.14) v1(0.76,28.6) v1(0.76,26.06) v1(0.76,23.52) v1(0.76,20.98) v1(0.76,18.44) v1(0.76,15.9) v1(0.76,13.36) v1(0.76,10.82) v1(0.76,8.28) v1(0.76,5.74) v1(1.34,40.64) v1(2.87,8.89) v1(3.12,42.42) v1(3.37,31.24) v1(4.14,24.13) v1(4.77,2.03) v1(5.41,26.67) v1(5.41,20.32) v1(5.41,16.51) v1(5.41,11.43) v1(5.41,6.35) v1(7.31,1.91) v1(7.54,42.54) v1(7.95,39.37) v1(7.95,39.37) v1(7.95,35.81) v1(7.95,29.21) v1(7.95,24.13) v1(7.95,19.05) v1(7.95,13.97) v1(7.95,8.89) v1(7.95,3.81) v1(9.85,1.78) v1(9.98,44.45) v1(10.49,41.91) v1(10.49,36.83) v1(10.49,31.75) v1(10.49,26.67) v1(10.49,6.35) v1(12.01,46.35) v1(12.39,1.65) v1(12.77,13.97) v1(13.03,44.45) v1(13.03,39.37) v1(13.03,34.29) v1(13.03,29.21) v1(13.03,19.05) v1(13.03,8.89) v1(13.66,50.8) v1(13.66,48.26) v1(14.93,52.7) v1(14.93,1.52) v1(15.57,46.99) v1(15.57,41.91) v1(15.57,36.83) v1(15.57,31.75) v1(15.57,26.67) v1(15.57,21.59) v1(15.57,16.51) v1(15.57,11.43) v1(16.84,54.41) v1(17.47,1.52) v1(18.11,49.53) v1(18.11,44.45) v1(18.11,39.37) v1(18.11,34.29) v1(18.11,29.21) v1(18.11,19.05) v1(18.11,13.97) v1(18.11,8.38) v1(19.38,54.48) v1(20.01,1.4) v1(20.65,46.99) v1(20.65,21.59) v1(20.65,16.51) v1(20.65,6.35) v1(21.92,54.51) v1(22.55,1.27) v1(23.19,49.53) v1(23.19,44.45) v1(23.19,23.22) v1(23.19,19.05) v1(23.16,14.22) v1(23.19,8.89) v1(23.19,3.81) v1(24.46,54.61) v1(25.09,1.27) v1(25.73,46.99) v1(25.73,41.91) v1(25.73,37.34) v1(25.73,21.59) v1(25.73,11.43) v1(25.73,6.35) v1(25.98,16.51) v1(27,54.71) v1(27.63,1.14) v1(28.27,44.7) v1(28.24,23.24) v1(28.27,19.05) v1(28.27,8.89) v1(28.52,14) v1(29.54,54.76) v1(30.17,1.14) v1(30.81,41.91) v1(30.81,21.59) v1(30.81,11.18) v1(31.14,16.51) v1(32.08,54.81) v1(32.64,1.02) v1(33.35,19.05) v1(33.35,13.97) v1(34.36,45.72) v1(34.62,54.86) v1(35,0.89) v1(35.89,11.43) v1(37.16,54.91) v1(37.31,0.89) v1(38.17,38.96) v1(38.43,13.97) v1(39.59,1.52) v1(39.7,54.1) v1(40.46,34.29) v1(40.97,49.53) v1(40.97,11.43) v1(41.98,1.91) v1(42.19,53.54) v1(42.74,15.49) v1(43.51,44.45) v1(43.51,28.96) v1(44.62,1.91) v1(44.73,53.54) v1(45.41,36.19) v1(46.05,49.02) v1(46.05,39.37) v1(47.27,53.54) v1(47.32,1.91) v1(48.33,7.62) v1(48.59,44.45) v1(48.59,35.56) v1(48.59,32.38) v1(49.81,53.54) v1(49.86,1.91) v1(50.87,9.65) v1(51.13,49.53) v1(51.13,39.37) v1(52.35,53.54) v1(52.4,1.91) v1(53.67,44.45) v1(53.67,34.29) v1(54.89,53.54) v1(54.94,15.24) v1(54.94,1.91) v1(56.21,49.53) v1(56.21,39.37) v1(56.71,19.81) v1(57.43,53.54) v1(57.48,29.97) v1(57.48,1.91) v1(58.75,44.45) v1(58.75,34.8) v1(58.75,11.43) v1(60.02,53.97) v1(60.02,29.97) v1(60.02,1.52) v1(61.29,49.53) v1(61.29,39.37) v1(61.29,13.97) v1(62.56,54.91) v1(62.56,0.86) v1(63.83,44.45) v1(63.83,34.8) v1(63.83,16.51) v1(63.83,11.43) v1(65.1,54.86) v1(65.1,26.67) v1(65.1,0.91) v1(66.37,49.53) v1(66.37,39.37) v1(66.37,31.75) v1(66.37,13.97) v1(66.37,6.35) v1(67.64,54.81) v1(67.64,0.97) v1(68.91,44.45) v1(68.91,34.8) v1(70.18,54.76) v1(70.18,26.67) v1(70.23,1.07) v1(71.45,49.53) v1(71.45,39.37) v1(71.45,31.75) v1(71.7,21.84) v1(72.72,54.71) v1(72.72,1.12) v1(73.99,44.45) v1(73.99,34.8) v1(73.99,16.51) v1(73.99,12.06) v1(75.26,54.61) v1(75.26,26.67) v1(75.26,1.17) v1(76.53,49.53) v1(76.53,39.37) v1(76.53,31.75) v1(76.53,14.22) v1(76.53,6.35) v1(76.78,21.84) v1(77.8,54.61) v1(77.8,1.17) v1(79.07,44.45) v1(79.07,34.8) v1(79.07,16.51) v1(79.07,12.06) v1(80.34,54.51) v1(80.34,1.17) v1(81.61,49.53) v1(81.61,39.37) v1(81.61,19.05) v1(81.61,14.22) v1(81.61,6.35) v1(82.88,54.41) v1(82.83,1.27) v1(84.15,44.45) v1(84.15,35.56) v1(84.15,31.75) v1(84.15,16.51) v1(84.15,12.06) v1(85.42,54.36) v1(85.42,1.32) v1(86.69,49.02) v1(86.69,21.59) v1(86.69,19.05) v1(86.69,13.97) v1(86.94,10.92) v1(87.96,54.25) v1(87.96,1.37) v1(88.59,35.56) v1(89.23,44.45) v1(89.23,22.86) v1(89.23,20.32) v1(89.23,17.78) v1(89.23,15.24) v1(89.23,12.7) v1(89.23,10.16) v1(89.23,7.62) v1(90.5,54.15) v1(90.5,51.51) v1(90.5,5.08) v1(90.5,1.42) v1(93.04,54.05) v1(93.04,1.52) v1(93.67,4.44) v1(94.05,2.79) v1(95.58,53.95) v1(96.85,29.72) v1(96.85,27.43) v1(97.15,32.21) v1(98.83,50.8) v1(98.83,48.26) v1(98.83,45.72) v1(98.83,43.18) v1(98.83,40.64) v1(98.83,37.85) v1(98.83,34.29)
VBAT-3V: length 67
  Top Layer w0.75: R1.2 R4.1 27.96,39.67 REF**#4.1
  Bottom Layer w0.5: R4.1 28.77,39.37 32.11,36.03 32.11,33.24 40.26,25.09 76.48,25.09 79.07,27.69 MCU1.6
CONN_EMG: length 23.9
  Top Layer w0.75: 21.05,7.62 32.39,7.62 34.62,9.84 R2.1 ; 21.05,7.62 20.01,7.62 18.03,5.63 J3.1 ; 21.05,7.62 20.9,7.77 REF**#5.1
CONN_RPM: length 7.9
  Top Layer w0.75: J3.3 13.03,6.35 10.49,8.89 D2.2
CONN_SPD: length 13.4
  Top Layer w0.75: J3.2 15.53,8.65 17.8,10.92 21.41,10.92 R7.1
DIO: length 72
  Top Layer w0.5: MCU1.24 56.21,7.57 v1(56.26,7.62) ; T1.14 8.08,33.83 v1(8.1,33.81)
  Bottom Layer w0.5: v1(56.26,7.62) 56.21,7.67 56.21,17.91 54.35,19.76 37.92,19.76 30.15,27.53 17.24,27.53 10.97,33.81 v1(8.1,33.81)
LED_ALIVE: length 20
  Top Layer w0.75: R3.1 78.53,24.84 63.62,24.84 61.29,27.18 MCU1.13
MISO: length 74
  Top Layer w0.5: MCU1.31 73.99,5.77 72.39,7.37 v1(67.64,7.37) ; T1.2 22.47,31.83 v1(22.55,31.75)
  Bottom Layer w0.5: v1(67.64,7.37) 67.64,19.18 65.99,20.83 38.43,20.83 30.63,28.63 27.01,28.63 23.89,31.75 v1(22.55,31.75)
MOSI: length 88.2
  Top Layer w0.5: MCU1.37 89.23,5.49 83.54,11.18 v1(70.18,11.18) ; T1.3 22.17,33.83 v1(22.2,33.81)
  Bottom Layer w0.5: v1(70.18,11.18) 70.18,20.09 67.31,22.96 39.34,22.96 28.5,33.81 v1(22.2,33.81)
NET-(C3-PAD1): length 11.7
  Top Layer w0.75: U1.1 35.93,20.3 C3.1 37.41,16.51 41.22,12.7 R2.2
NET-(C4-PAD1): length 11.7
  Top Layer w0.75: R7.2 28.27,12.7 27,13.97 27,14.01 C4.1 24.5,20.28 U3.1
NET-(D1-A): length 15.9
  Top Layer w0.5: 87.96,26.64 87.96,30.2
  Top Layer w0.75: R3.2 87.96,26.64 ; 87.96,30.2 89.25,31.5 91.36,31.5 94.97,35.1 D1.2
NET-(D2-K): length 3.8
  Top Layer w0.75: D2.1 R6.1
NET-(D3-K): length 13.2
  Top Layer w0.75: C5.1 D3.1 R6.2 13.03,15.24 14.31,13.95 U2.1
NSS: length 75.3
  Top Layer w0.5: T1.5 20.22,37.85 23.95,37.85 25,36.79 v1(25,32.22)
  Bottom Layer w0.5: v1(25,32.22) 27.54,29.68 31.12,29.68 38.9,21.89 66.65,21.89 68.91,19.63 MCU1.29
RST: length 51.1
  Top Layer w0.5: v1(22.55,39.8) 22.52,39.83 T1.6
  Bottom Layer w0.5: v1(22.55,39.8) 25.93,39.8 27.24,41.11 29.07,41.11 33.51,36.66 33.51,34.89 34.91,33.49 38.21,33.49 40.75,30.95 62.85,30.95 63.83,29.97 MCU1.12
RXD2: length 36.4
  Bottom Layer w0.5: MCU1.27 63.83,4.44 63.04,5.23 45,5.23 43.89,6.35 31.44,6.35 30.73,5.63 J2.2
SCK: length 77.2
  Top Layer w0.5: v1(22.21,35.81) 22.19,35.83 T1.4
  Bottom Layer w0.5: MCU1.30 71.45,20.57 67.99,24.03 39.8,24.03 30.84,32.98 30.84,35.27 29.01,37.1 27.37,37.1 26.08,35.81 v1(22.21,35.81)
SCL: length 96.3
  Top Layer w0.5: v1(53.41,15.37) 53.41,10.86 54.31,9.96 82.29,9.96 86.69,5.56 MCU1.36 ; v1(47.98,15.34) 47.98,20.32 43.1,25.2 35.86,25.2 33.52,27.53 33.52,43.97 30.22,47.27 30.22,50.11 29.54,50.8 S1.3
  Bottom Layer w0.5: v1(47.98,15.34) 48,15.37 v1(53.41,15.37)
SDA: length 91.5
  Top Layer w0.5: MCU1.33 79.07,6.55 76.78,8.84 53.53,8.84 52.14,10.22 v1(52.14,13.97) ; S1.4 27,51.03 28.88,49.15 28.88,46.79 32.25,43.41 32.25,27 35.12,24.13 42.62,24.13 46.76,19.99 v1(46.76,13.97)
  Bottom Layer w0.5: v1(52.14,13.97) v1(46.76,13.97)
SIGNAL_EMG: length 65.2
  Top Layer w0.5: v1(73.99,20.83) 62.43,20.83 58.37,16.76 v1(53.79,16.76) ; U1.4 41.91,27.95 49.22,20.64 v1(49.22,16.76)
  Top Layer w0.75: REF**.1 42.44,29.41 U1.4 40.98,28.99 38.22,31.75 R5.1
  Bottom Layer w0.5: v1(49.22,16.76) v1(53.79,16.76) ; v1(73.99,20.83) 77.39,20.83 81.61,25.04 MCU1.5
SIGNAL_RPM: length 91.8
  Top Layer w0.5: v1(54.94,11.18) 55.95,11.18 62.81,18.03 v1(76.53,18.03) ; R8.1 31.57,24.13 33.7,22 41.68,22 44.32,19.35 v1(44.32,11.18)
  Top Layer w0.75: R8.1 19.38,22.86 19.38,22.22 19.39,22.21 U2.4 19.43,20.37 REF**#2.1
  Bottom Layer w0.5: v1(76.53,18.03) 78.43,18.03 84.35,23.95 84.35,25.6 86.69,27.94 MCU1.3 ; v1(54.94,11.18) v1(44.32,11.18)
SIGNAL_SPD: length 86.4
  Top Layer w0.5: v1(45.54,12.6) 45.54,19.66 42.13,23.06 34.35,23.06 29.54,27.88 U3.4 ; v1(54.68,12.57) 55.73,12.57 62.59,19.43 v1(75.26,19.43)
  Top Layer w0.75: R9.1 27.25,35.56 26.36,34.67 26.36,31.11 U3.4 30.55,28.96 REF**#6.1
  Bottom Layer w0.5: v1(45.54,12.6) 45.56,12.57 v1(54.68,12.57) ; MCU1.4 84.15,27.3 83,26.16 83,24.51 77.92,19.43 v1(75.26,19.43)
TXD2: length 42.6
  Bottom Layer w0.5: J2.3 28.23,5.67 30.15,7.6 44.42,7.6 45.72,6.3 64.64,6.3 66.37,4.57 MCU1.28

## Copper pours and planes (outline as drawn; the poured copper is in the pictures)
GND on Top Layer: -4.75,59.69 104.47,59.69 104.47,-3.81 -4.75,-3.81
GND on Bottom Layer: -4.75,59.69 104.47,59.69 104.47,-3.81 -4.75,-3.81

## Text on the board
Top Silkscreen Layer: WayWayWay | UECU | v2.4

# Board UECU_1
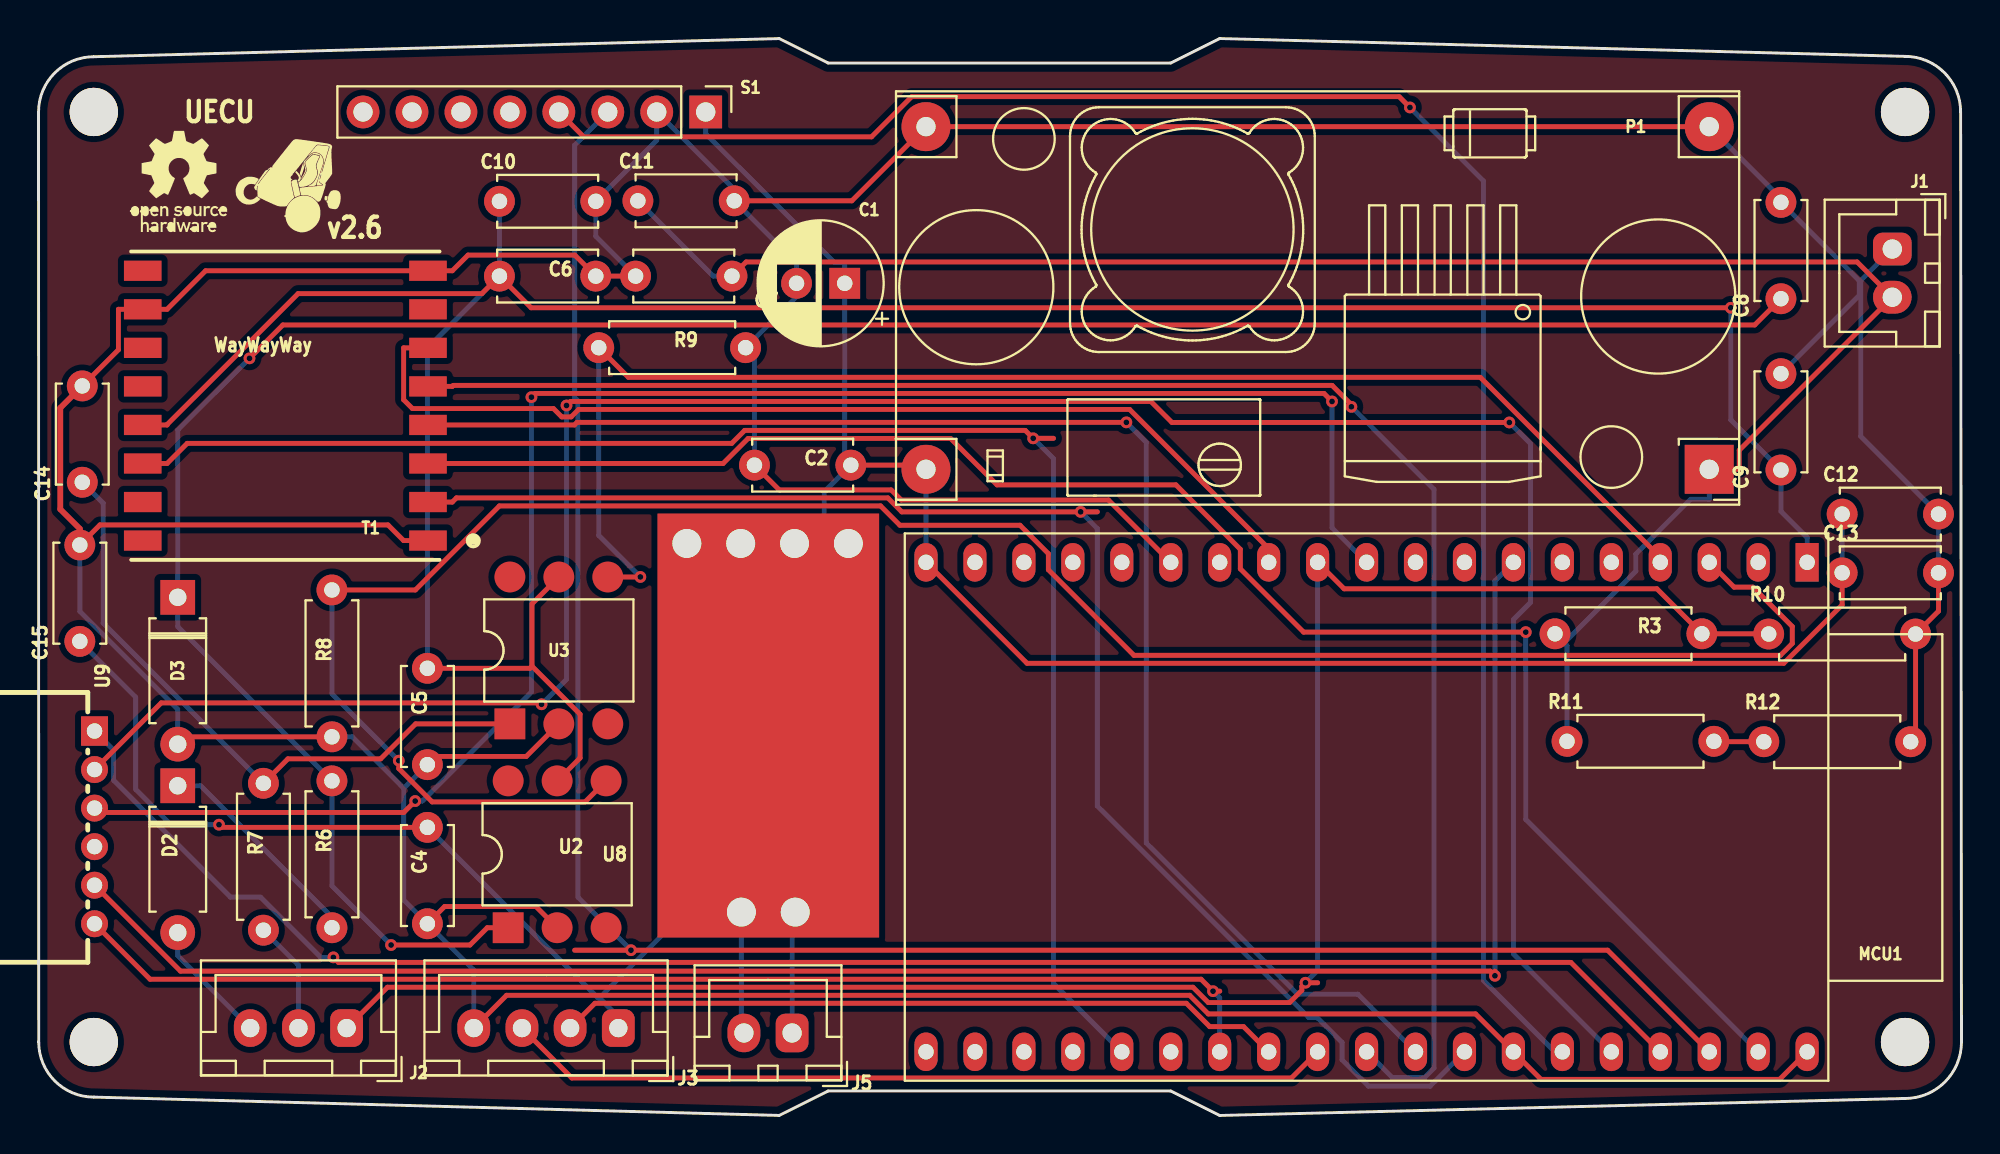
[diagram p3: board, top side]
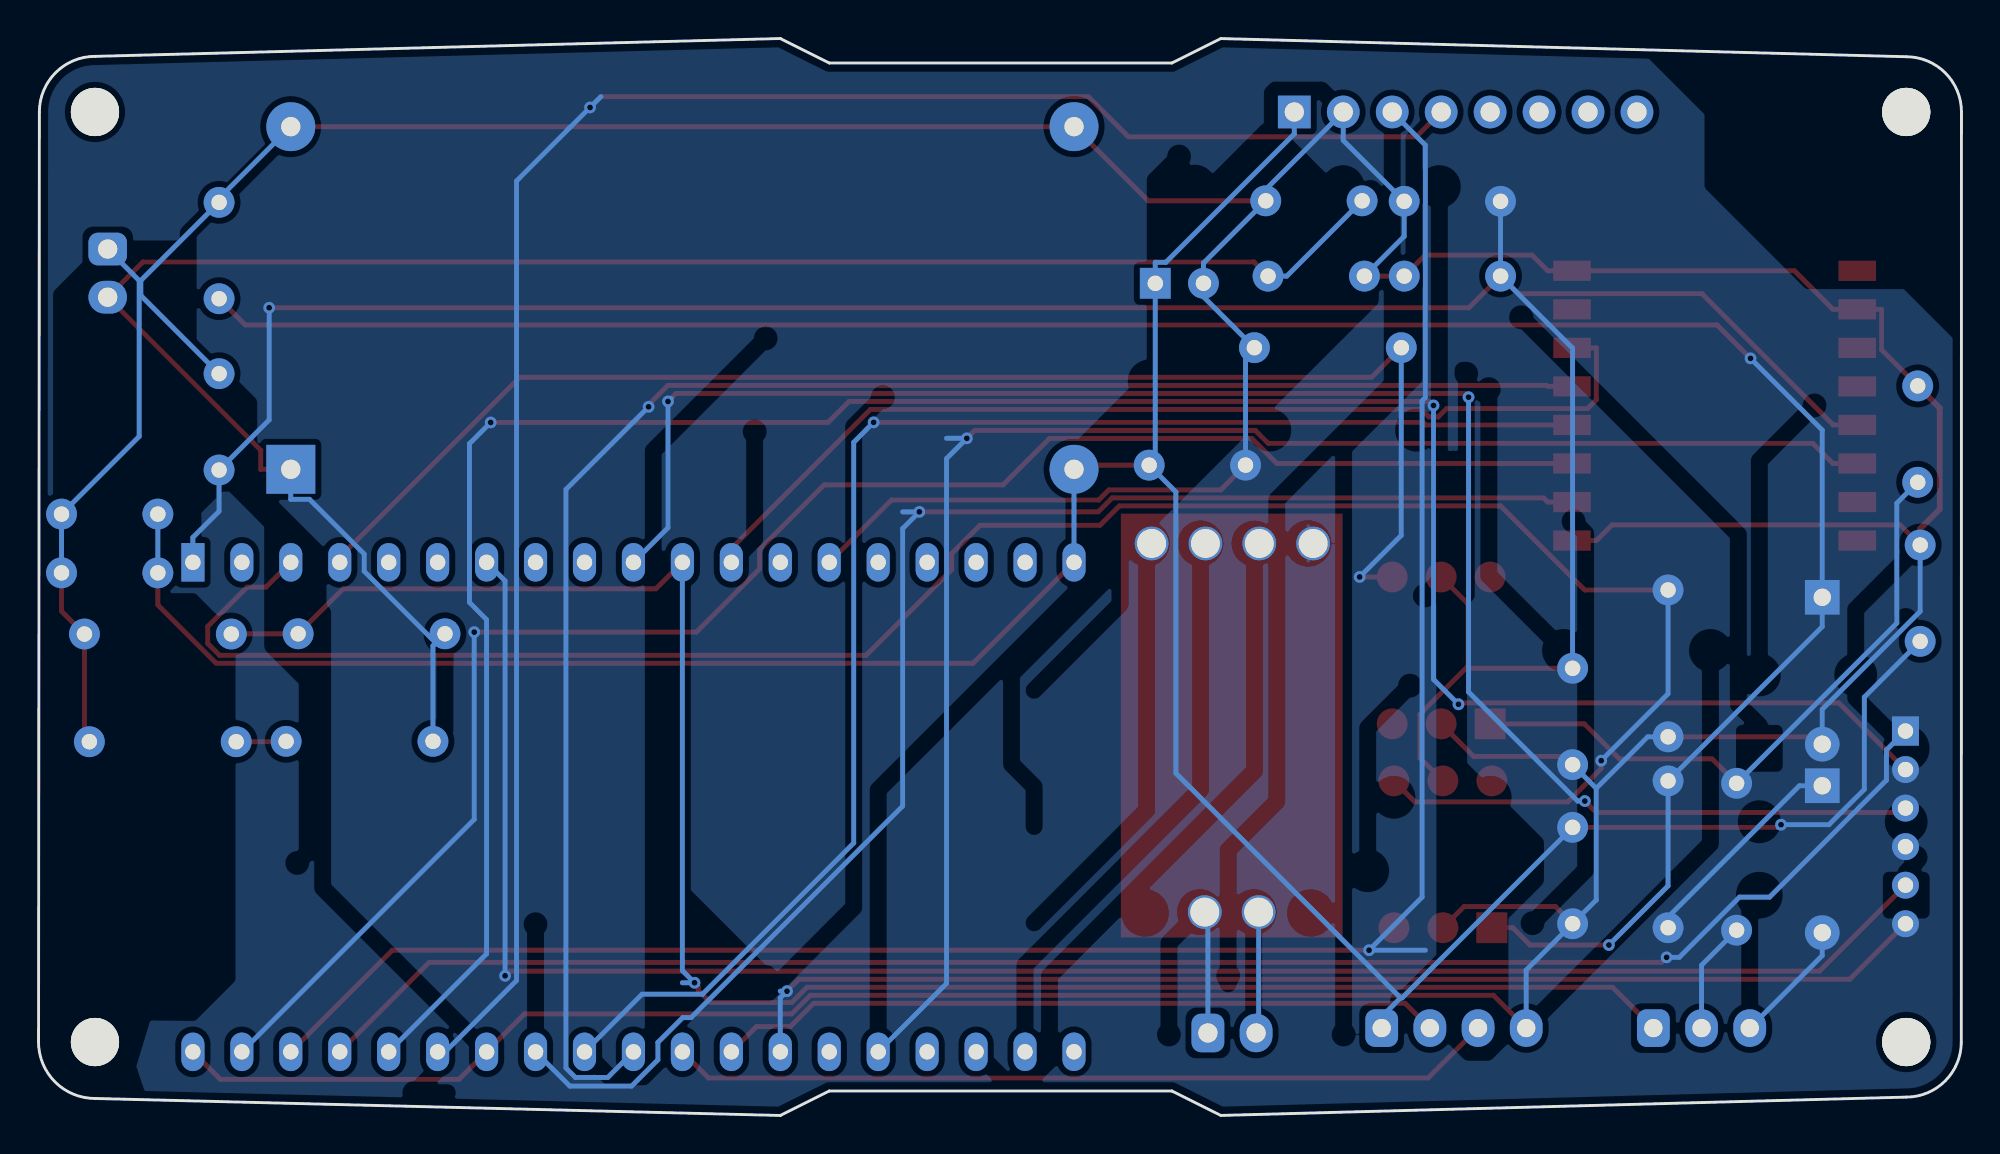
[diagram p4: board, bottom side, seen from below]

Outline 99.77 x 55.88 mm; copper layers: Top Layer, Bottom Layer. Coordinates in mm from the lower left corner of the outline.
Outline path: 0,52.07 0.01,3.81 arc(0.85,1.79) 2.87,0.95 38.43,0 40.97,1.27 58.75,1.27 61.29,0 96.85,0.88 arc(98.92,1.74) 99.77,3.81 99.73,52.07 arc(98.89,54.11) 96.85,54.95 61.29,55.88 58.75,54.61 40.97,54.61 38.43,55.88 2.87,54.94 arc(0.84,54.1) 0,52.07
Stack: Top Layer 0.0009mm / dielectric 1 0.0384mm FR4 er 4.5 / Bottom Layer 0.0009mm

## Design rules (mm)
spacing safeClearance (default): track to track 0.152, other pairs 0.152 to 0.3
track width trackWidth (default): min 0.127, default 0.254, max 2.54
differential pair differentialPair (default): width min 0.127, default 0.254, max 2.54; gap min 0.152, default 0.152
via viaSize (default): diameter min 0.5, default 0.61, max 10; hole min 0.3, default 0.305, max 6
pour ie1130 uses CopperRegion1

## Placement (name value [footprint] x y rotation side)
C1  470uF  [Capacitor_THT:CP_Radial_D6.3mm_P2.50mm]  41.83 43.18 180 top
C2  100nF  [Capacitor_THT:C_Disc_D5.0mm_W2.5mm_P5.00mm]  42.15 33.74 180 top
C4  100nF  [Capacitor_THT:C_Disc_D5.0mm_W2.5mm_P5.00mm]  20.18 14.95 270 top
C5  10uF  [Capacitor_THT:C_Disc_D5.0mm_W2.5mm_P5.00mm]  20.18 23.2 270 top
C6  100nF  [Capacitor_THT:C_Disc_D5.0mm_W2.5mm_P5.00mm]  23.91 43.55 0 top
C7  10uF  [Capacitor_THT:C_Disc_D5.0mm_W2.5mm_P5.00mm]  35.98 43.55 180 top
C8  10pF  [Capacitor_THT:C_Disc_D5.0mm_W2.5mm_P5.00mm]  90.41 42.38 90 top
C9  10uF  [Capacitor_THT:C_Disc_D5.0mm_W2.5mm_P5.00mm]  90.41 33.49 90 top
C10  100nF  [Capacitor_THT:C_Disc_D5.0mm_W2.5mm_P5.00mm]  23.92 47.43 0 top
C11  100nF  [Capacitor_THT:C_Disc_D5.0mm_W2.5mm_P5.00mm]  31.1 47.46 0 top
C12  10uF  [Capacitor_THT:C_Disc_D5.0mm_W2.5mm_P5.00mm]  93.58 31.2 0 top
C13  10uF  [Capacitor_THT:C_Disc_D5.0mm_W2.5mm_P5.00mm]  93.58 28.16 0 top
C14  10pF  [Capacitor_THT:C_Disc_D5.0mm_W2.5mm_P5.00mm]  2.27 32.85 90 top
C15  100nF  [Capacitor_THT:C_Disc_D5.0mm_W2.5mm_P5.00mm]  2.14 24.6 90 top
D2  1N4007  [Diode_THT:D_A-405_P7.62mm_Horizontal]  7.22 17.11 270 top
D3  ZENER 3V3  [Diode_THT:D_A-405_P7.62mm_Horizontal]  7.22 26.89 270 top
H1  3.7  [MountingHole:MountingHole_3.7mm]  2.87 52.07 0 top
H2  3.7  [MountingHole:MountingHole_3.7mm]  96.85 52.07 0 top
H3  3.7  [MountingHole:MountingHole_3.7mm]  2.87 3.81 0 top
H4  3.7  [MountingHole:MountingHole_3.7mm]  96.85 3.81 0 top
J1  CONN_PWR  [Connector_JST:JST_XH_B2B-XH-A_1x02_P2.50mm_Vertical]  96.19 44.96 270 top
J2  CONN_SENSORS  [Connector_JST:JST_XH_B3B-XH-A_1x03_P2.50mm_Vertical]  15.99 4.53 180 top
J3  CONN_DISPLAY  [Connector_JST:JST_XH_B4B-XH-A_1x04_P2.50mm_Vertical]  30.08 4.53 180 top
J5  CONN_CAN_BUS  [Connector_JST:JST_XH_B2B-XH-A_1x02_P2.50mm_Vertical]  39.1 4.28 180 top
L1  ~  [Logos:parahybaja]  13.03 48.26 0 top
L2  ~  [Logos:open_hardware]  7.29 48.46 0 top
MCU1  ESP32-DevKitC  [Espressif:ESP32-DevKitC]  91.77 28.7 270 top
P1  LM2596_buck  [StepDown:StepDown_LM2596]  86.69 33.53 180 top
R3  20kR  [Resistor_THT:R_Axial_DIN0207_L6.3mm_D2.5mm_P7.62mm_Horizontal]  78.69 24.99 0 top
R6  59k  [Resistor_THT:R_Axial_DIN0207_L6.3mm_D2.5mm_P7.62mm_Horizontal]  15.22 9.74 90 top
R7  2k  [Resistor_THT:R_Axial_DIN0207_L6.3mm_D2.5mm_P7.62mm_Horizontal]  11.67 9.61 90 top
R8  10k  [Resistor_THT:R_Axial_DIN0207_L6.3mm_D2.5mm_P7.62mm_Horizontal]  15.22 27.27 270 top
R9  10k  [Resistor_THT:R_Axial_DIN0207_L6.3mm_D2.5mm_P7.62mm_Horizontal]  29.07 39.84 0 top
R10  6k8  [Resistor_THT:R_Axial_DIN0207_L6.3mm_D2.5mm_P7.62mm_Horizontal]  89.77 24.98 0 top
R11  20kR  [Resistor_THT:R_Axial_DIN0207_L6.3mm_D2.5mm_P7.62mm_Horizontal]  79.31 19.41 0 top
R12  6k8  [Resistor_THT:R_Axial_DIN0207_L6.3mm_D2.5mm_P7.62mm_Horizontal]  89.52 19.39 0 top
S1  ~  [Connector_PinHeader_2.54mm:PinHeader_1x08_P2.54mm_Vertical]  34.62 52.07 270 top
T1  LoRa-SX1276  [LoRa_SX1276:LoRa_SX1276]  12.81 36.83 180 top
U2  4N25  [Package_DIP:DIP-6_W7.62mm]  24.37 9.74 90 top
U3  4N25  [Package_DIP:DIP-6_W7.62mm]  24.46 20.32 90 top
U8  -  [CAN Module TJA1050]  32.11 9.23 0 top
U9  PH2.0mm间距弯针插座6P红色  [CONN-TH_6P-P2.00_KINGHELM_KH-PH-6P-W]  2.9 14.95 270 top

## Footprints (pads in the part's own frame, mm; a bottom-side part is the same pattern mirrored in y, then rotated)
CAN Module TJA1050
  round 1.75 hole 1.5x1: 1(1.524,20.447) 2(4.318,20.447) 3(7.112,20.447) 4(9.906,20.447) 5(4.353,1.319) 6(7.147,1.319)
Capacitor_THT:C_Disc_D5.0mm_W2.5mm_P5.00mm
  round 1.6 hole 0.8: 1(0,0) 2(5,0)
Capacitor_THT:CP_Radial_D6.3mm_P2.50mm
  rect 1.6x1.6 hole 0.8: 1(0,0)
  round 1.6 hole 0.8: 2(2.5,0)
CONN-TH_6P-P2.00_KINGHELM_KH-PH-6P-W
  rect 1.524x1.4 hole 0.8: 1(-5,0)
  round 1.4 hole 0.8: 2(-3,0) 3(-1,0) 4(1,0) 5(3,0) 6(5,0)
Connector_JST:JST_XH_B2B-XH-A_1x02_P2.50mm_Vertical
  rrect 1.7x2 hole 1: 1(0,0)
  oval 1.7x2 hole 1: 2(2.5,0)
Connector_JST:JST_XH_B3B-XH-A_1x03_P2.50mm_Vertical
  rrect 1.7x1.95 hole 0.95: 1(0,0)
  oval 1.7x1.95 hole 0.95: 2(2.5,0) 3(5,0)
Connector_JST:JST_XH_B4B-XH-A_1x04_P2.50mm_Vertical
  rrect 1.7x1.95 hole 0.95: 1(0,0)
  oval 1.7x1.95 hole 0.95: 2(2.5,0) 3(5,0) 4(7.5,0)
Connector_PinHeader_2.54mm:PinHeader_1x08_P2.54mm_Vertical
  rect 1.7x1.7 hole 1: 1(0,0)
  round 1.7 hole 1: 2(0,-2.54) 3(0,-5.08) 4(0,-7.62) 5(0,-10.16) 6(0,-12.7) 7(0,-15.24) 8(0,-17.78)
Diode_THT:D_A-405_P7.62mm_Horizontal
  rect 1.8x1.8 hole 0.9: 1(0,0)
  round 1.8 hole 0.9: 2(7.62,0)
Espressif:ESP32-DevKitC
  rect 2x1.2 hole 0.8: 1(0,0)
  oval 2x1.2 hole 0.8: 2(0,-2.54) 3(0,-5.08) 4(0,-7.62) 5(0,-10.16) 6(0,-12.7) 7(0,-15.24) 8(0,-17.78) 9(0,-20.32) 10(0,-22.86) 11(0,-25.4) 12(0,-27.94) 13(0,-30.48) 14(0,-33.02) 15(0,-35.56) 16(0,-38.1) 17(0,-40.64) 18(0,-43.18) 19(0,-45.72) 20(25.396,-45.718) 21(25.396,-43.178) 22(25.4,-40.64) 23(25.4,-38.1) 24(25.4,-35.56) 25(25.4,-33.02) 26(25.4,-30.48) 27(25.4,-27.94) 28(25.4,-25.4) 29(25.4,-22.86) 30(25.4,-20.32) 31(25.4,-17.78) 32(25.4,-15.24) 33(25.4,-12.7) 34(25.4,-10.16) 35(25.4,-7.62) 36(25.4,-5.08) 37(25.4,-2.54) 38(25.4,0)
LoRa_SX1276:LoRa_SX1276
  rect 1.95x1.05 smd: 1(-7.4,7) 2(-7.4,5) 3(-7.4,3) 4(-7.4,1) 5(-7.4,-1) 6(-7.4,-3) 7(-7.4,-5) 8(-7.4,-7) 9(7.4,-7) 10(7.4,-5) 11(7.4,-3) 12(7.4,-1) 13(7.4,1) 14(7.4,3) 15(7.4,5) 16(7.4,7)
MountingHole:MountingHole_3.7mm
  round 2.5 hole 2.5: (0,0)
Package_DIP:DIP-6_W7.62mm
  rect 1.6x1.6 smd: 1(0,0)
  round 1.6 smd: 2(0,-2.54) 3(0,-5.08) 4(7.62,-5.08) 5(7.62,-2.54) 6(7.62,0)
Resistor_THT:R_Axial_DIN0207_L6.3mm_D2.5mm_P7.62mm_Horizontal
  round 1.6 hole 0.8: 1(0,0) 2(7.62,0)
StepDown:StepDown_LM2596
  rect 2.54x2.54 hole 1: 1(0,0)
  round 2.54 hole 1: 2(0,-17.78) 3(40.64,-17.78) 4(40.64,0)

## Nets
As in the schematic.

Pads without a net: MCU1 2 8 13 15 16 17 18 20 25; S1 5 6 7 8; T1 7 9 11 12 15 16; U2 3 6; U3 3 6; U8 1 2 3 4

## Via types
v1: diameter 0.61, hole 0.305, Top Layer to Bottom Layer, 23 vias

## Routing (per net, layer and track width the routed paths; a pad name or vN(x,y) marks a point on that pad's centre or on a via; arc(x,y) is an arc through that point)
+12V: length 100.1
  Top Layer w0.254: P1.1 88.24,33.53 88.24,34.52 J1.2 94.36,44.29 36.71,44.29 35.98,43.55
  Bottom Layer w0.254: C11.1 35.01,43.55 35.98,43.55 ; 79.16,24.52 79.31,24.37 R11.1 ; 79.16,24.52 82.88,28.24 82.88,29.13 85.71,31.97 86.69,31.97 P1.1 ; 79.16,24.52 R3.1
4X4: length 96.7
  Top Layer w0.254: 75.57,7.49 v1(75.57,7.25) 75.33,7.49 7.37,7.49 2.91,11.95
  Bottom Layer w0.254: MCU1.7 75.57,27.74 v1(75.57,7.25)
BREAK: length 63.5
  Top Layer w0.254: 61.29,6.45 v1(60.94,6.45) 60.32,7.07 5.79,7.07 2.91,9.95
  Bottom Layer w0.254: 61.29,6.45 v1(60.94,6.45) 61.29,6.1 MCU1.26
BREAK_PIN: length 2.6
  Top Layer w0.254: R12.1 86.95,19.39 R11.2
DIO: length 82.9
  Top Layer w0.254: T1.14 6.67,33.83 7.71,34.87 35.97,34.87 36.64,35.55 51.2,35.55 v1(51.61,35.14) 52.66,35.14
  Bottom Layer w0.254: MCU1.24 52.66,6.85 52.66,34.08 v1(51.61,35.14) 52.66,35.14
MISO: length 77.9
  Top Layer w0.254: 20.21,31.83 21.47,31.83 21.68,32.04 44.07,32.04 44.79,31.32 v1(54.07,31.32) 54.94,31.32
  Bottom Layer w0.254: 54.94,31.32 v1(54.07,31.32) 54.94,30.45 54.94,16.06 65.92,5.08 66.35,5.08 67.64,3.79 67.64,2.89 69,1.52 72.21,1.52 MCU1.31
MOSI: length 89
  Top Layer w0.254: T1.3 35.52,33.83 36.82,35.13 47.32,35.13 49.73,32.72 59.01,32.72 62.36,29.38 62.36,28.36 65.64,25.08 v1(77.17,25.08)
  Bottom Layer w0.254: v1(77.17,25.08) 77.17,15.36 MCU1.37
NSS: length 88.8
  Top Layer w0.254: v1(68.12,36.77) 68.12,36.88 67.12,37.88 21.52,37.88 21.47,37.83 T1.5
  Bottom Layer w0.254: MCU1.29 70.24,1.97 71.92,1.97 72.41,2.46 72.41,32.48 v1(68.12,36.77)
PIN_1: length 89.2
  Top Layer w0.254: v1(15.3,8.2) 15.56,7.94 79.51,7.94 MCU1.35
  Bottom Layer w0.254: 2.91,19.95 3.89,18.96 3.89,17.39 9.96,11.33 11.52,11.33 14.64,8.2 v1(15.3,8.2) 15.39,8.11
PIN_3: length 125.8
  Top Layer w0.254: v1(76.31,35.96) 58.81,35.96 57.72,37.05 27.6,37.05 v1(27.39,36.84) ; v1(26.1,21.34) 26.03,21.41 6.37,21.41 2.91,17.95
  Bottom Layer w0.254: MCU1.34 76.53,8.38 76.53,25.73 77.42,26.62 77.42,34.85 v1(76.31,35.96) ; v1(27.39,36.84) 27.39,22.63 v1(26.1,21.34) 26.03,21.41
PIN_12: length 99.8
  Top Layer w0.254: J2.1 18.11,6.65 59.9,6.65 60.7,5.86 64.91,5.86 65.55,6.49 65.55,6.7 v1(65.74,6.89) 66.37,6.89 ; 89.77,24.98 89.76,24.99 R3.2 83.97,27.33 67.74,27.33 MCU1.11
  Bottom Layer w0.254: MCU1.11 66.37,7.52 v1(65.74,6.89) 66.37,6.89
PIN_26: length 91.8
  Top Layer w0.254: 2.91,15.95 3.13,15.72 18.95,15.72 v1(19.54,16.31) ; v1(67.11,37.05) 66.7,37.46 25.77,37.46 v1(25.58,37.27)
  Bottom Layer w0.254: v1(19.54,16.31) 19.92,16.31 25.58,21.97 v1(25.58,37.27) ; MCU1.10 67.11,30.49 v1(67.11,37.05) 66.96,37.21
POWER_+3V3: length 145.1
  Top Layer w0.254: T1.13 6.67,35.83 6.67,35.85 13.47,42.64 23,42.64 23.91,43.55 25.56,41.91 v1(87.81,41.91) ; 25.61,23.31 25.61,26.55 27,27.94 ; 25.61,23.31 25.5,23.2 20.18,23.2 ; 25.61,23.31 28.1,20.82 28.1,18.55 U2.5
  Bottom Layer w0.254: 20.18,23.2 20.18,39.82 23.92,43.56 C10.1 ; v1(87.81,41.91) 87.81,36.09 90.41,33.49 90.41,31.35 91.77,29.99 MCU1.1
POWER_+5V: length 158.9
  Top Layer w0.254: MCU1.19 51.29,23.46 90.55,23.46 93.58,26.49 C13.1 ; 20.18,14.95 9.5,14.95 v1(9.36,15.09) ; P1.4 45.83,33.74 42.15,33.74
  Bottom Layer w0.254: P1.4 MCU1.19 ; C15.1 5.04,21.7 5.04,16.92 6.88,15.09 v1(9.36,15.09) 9.5,14.95 ; 29.1,6.1 40.76,17.76 40.76,32.36 42.15,33.74 41.83,34.06 C1.1 41.83,44.27 41.28,44.27 34.62,50.93 34.62,52.07 ; 29.1,6.1 30.08,5.12 J3.1 ; 29.1,6.1 29.02,6.1 20.18,14.95 ; C13.1 C12.1
POWER_GND: length 345.3
  Top Layer w0.254: MCU1.14 55.52,31.93 44.77,31.93 44.24,32.46 38.43,32.46 C2.2 ; P1.2 P1.3 42.2,47.46 C11.2 ; D3.2 7.6,19.65 15.22,19.65 ; 20.18,18.2 20.6,18.63 25.31,18.63 27,20.32 ; C13.2 98.58,26.17 97.39,24.98 97.39,19.65 R12.2 ; MCU1.38 90.34,1.87 77.96,1.87 MCU1.32 74.56,5.27 60.7,5.27 59.73,6.24 24.28,6.24 J3.4 ; 20.18,9.95 21.07,10.84 25.81,10.84 U2.2 ; 2.14,29.6 3.19,30.64 18.13,30.64 18.94,29.83 T1.1 ; 2.27,37.86 4.14,39.73 4.14,41.83 6.67,41.83 8.67,43.83 T1.8 21.47,43.83 22.28,44.64 27.83,44.64 28.92,43.55 30.98,43.55
  Top Layer w0.3: C14.2 1.13,36.71 1.13,31.46 2.14,30.44 C15.2
  Bottom Layer w0.254: 18.95,16.97 16.28,19.65 15.22,19.65 ; 18.95,16.97 20.18,18.2 ; 18.95,16.97 18.95,11.18 20.18,9.95 22.58,7.54 J3.4 ; 30.98,43.55 28.92,45.62 28.92,47.43 32.08,50.6 32.08,52.07 36.1,48.05 C11.2 39.33,44.23 C1.2 39.33,42.48 R9.2 37.15,39.38 C2.2 ; D3.2 7.22,21.07 2.14,26.15 2.14,29.6 ; 94.55,43.32 J1.1 ; 94.55,43.32 94.47,43.32 ; 94.55,43.32 94.55,35.23 C12.2 C13.2 ; 94.47,43.32 90.41,47.38 90.41,47.59 P1.2 ; 94.47,43.32 94.47,42.55 90.41,38.49
RPM: length 6.5
  Bottom Layer w0.254: D2.2 7.22,8.3 J2.3
RST: length 53.1
  Top Layer w0.254: T1.6 18.94,39.83 18.94,37.14 19.4,36.68 26.72,36.68 27.15,36.25 27.64,36.25 28.02,36.63 56.61,36.63 63.83,29.42 MCU1.12
RXD2: length 37.8
  Top Layer w0.254: MCU1.27 62.52,4.61 60.77,4.61 59.56,5.82 28.87,5.82 J3.2
SCK: length 77
  Top Layer w0.254: T1.4 27.81,35.83 27.94,35.96 v1(56.44,35.96)
  Bottom Layer w0.254: 56.43,35.98 v1(56.44,35.96) 57.48,34.93 57.48,14.14 65.32,6.29 68.46,6.29 MCU1.30
SCL: length 109.4
  Top Layer w0.254: MCU1.36 81.41,8.57 v1(30.74,8.57) 27.82,8.57
  Bottom Layer w0.254: 27.82,8.57 v1(30.74,8.57) 27.99,11.33 27.99,37.09 27.82,37.25 27.82,50.35 29.54,52.07
SDA: length 99.1
  Top Layer w0.254: v1(71.16,52.3) 70.6,52.86 45.31,52.86 43.22,50.78 28.29,50.78 27,52.07
  Bottom Layer w0.254: 70.6,52.86 v1(71.16,52.3) 74.97,48.49 74.97,7 78.67,3.3 MCU1.33
SIGNAL_RPM: length 110.8
  Top Layer w0.254: 15.22,27.27 19.55,27.27 23.91,31.63 43.69,31.63 44.69,30.62 50.92,30.62 52.4,29.15 52.4,28.32 56.84,23.88 90.38,23.88 91,24.49 91,25.37 88.95,27.41 87.98,27.41 MCU1.3 ; 29.45,17.36 28.36,16.27 20.42,16.27 18.69,18 v1(18.69,18.41)
  Bottom Layer w0.254: 18.69,18.32 v1(18.69,18.41) 15.22,21.88 15.22,27.27
SIGNAL_SPD: length 74.3
  Top Layer w0.254: R9.1 30.61,38.3 74.81,38.3 84.15,28.96 MCU1.4 ; v1(31.23,27.94) 31.22,27.94 29.54,27.94
  Bottom Layer w0.254: v1(31.23,27.94) 29.07,30.1 R9.1
SPD: length 5.8
  Bottom Layer w0.254: 13.48,4.53 13.48,7.8 11.67,9.61
TXD2: length 42.9
  Top Layer w0.254: MCU1.28 65.01,1.95 27.67,1.95 J3.3
$1N3: length 123.8
  Top Layer w0.254: v1(18.29,8.84) 22.39,8.84 23.28,9.74 24.37,9.74 ; v1(10.95,39.29) 12.68,41.02 89.05,41.02 90.41,42.38
  Bottom Layer w0.254: v1(10.95,39.29) 7.22,35.56 D3.1 7.22,25.36 15.22,17.36 15.22,11.91 v1(18.29,8.84)
$1N7: length 11.4
  Bottom Layer w0.254: D2.1 8.41,17.11 15.22,10.29 15.22,9.74
$1N75: length 33.6
  Top Layer w0.254: 11.67,17.23 12.94,18.5 17.75,18.5 19.57,20.32 24.46,20.32
  Bottom Layer w0.254: C14.1 3.36,31.77 3.36,25.55 11.67,17.23
$1N8433: length 6.3
  Bottom Layer w0.254: 39.26,10.55 39.1,10.39 39.1,4.28
$1N8440: length 6.3
  Bottom Layer w0.254: J5.2 36.47,4.41 36.47,10.55

## Copper pours and planes (outline as drawn; the poured copper is in the pictures)
GND on Top Layer: -4.75,59.69 104.47,59.69 104.47,-3.81 -4.75,-3.81
GND on Bottom Layer: -4.75,59.69 104.47,59.69 104.47,-3.81 -4.75,-3.81

## Text on the board
Top Silkscreen Layer: WayWayWay | UECU | v2.6
